# EAGLE schematic qo-100-gpsdo (EAGLE 9.6.2)
CREVISION: 1; DESIGNER: Joao Silva

## Sheet 1 of 6: MCU
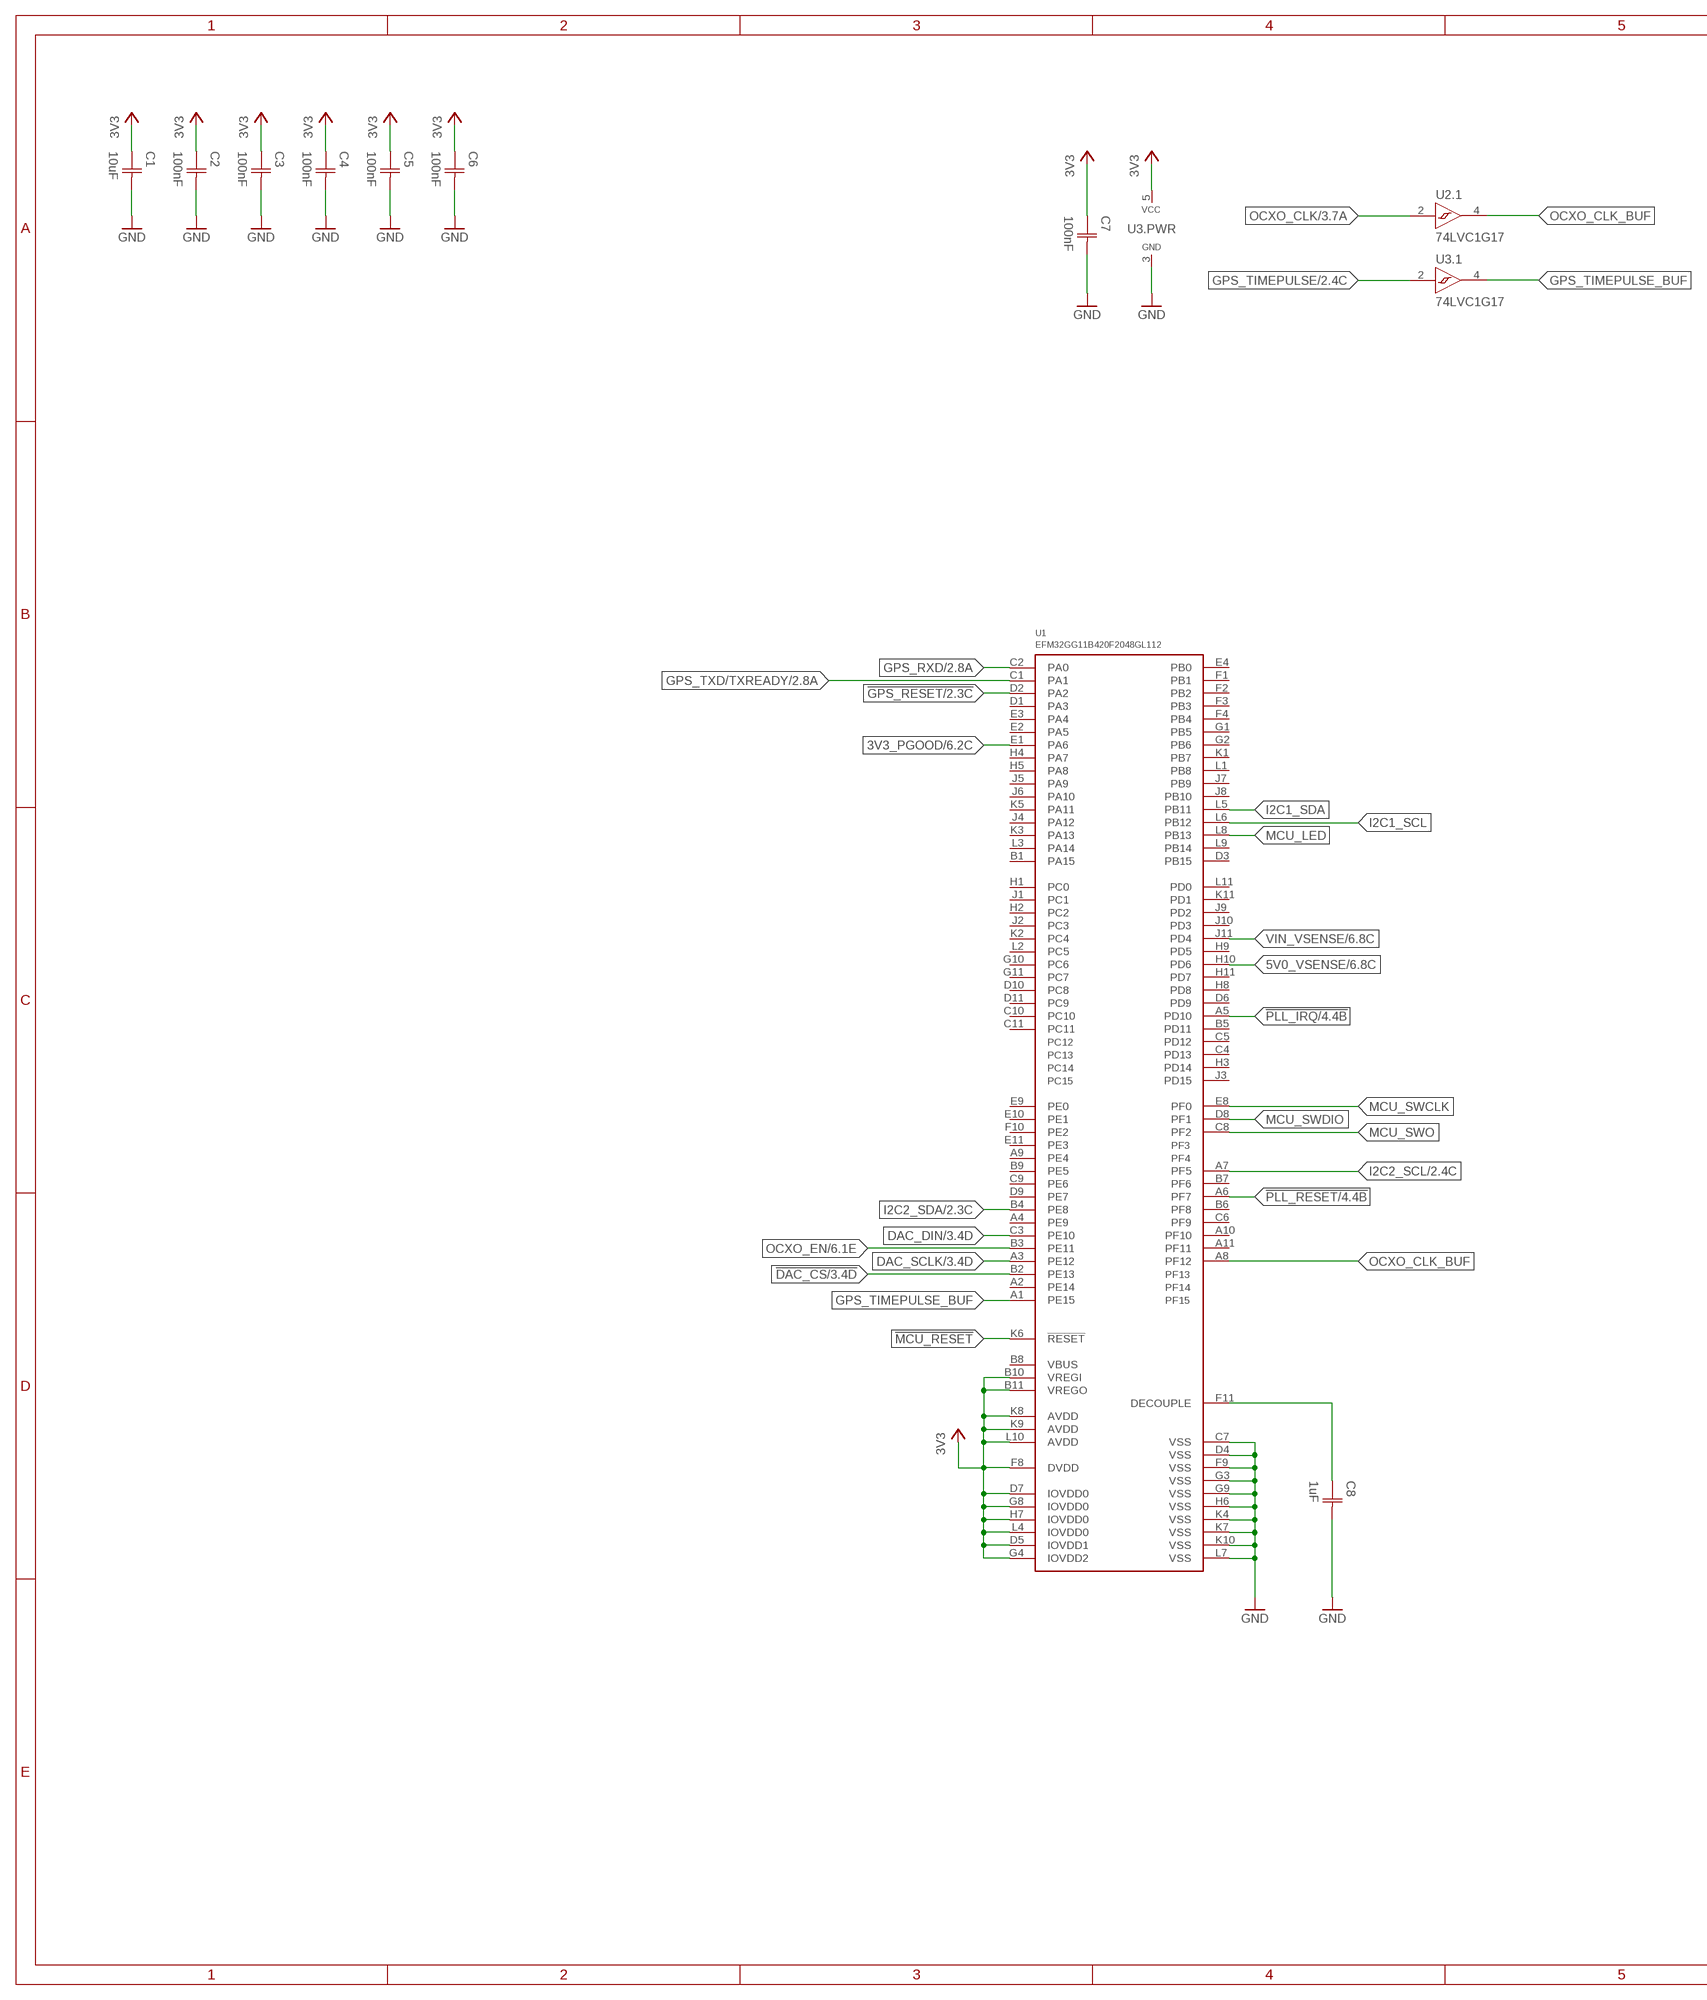
[diagram p0: schematic, sheet 1, part 1 of 2]
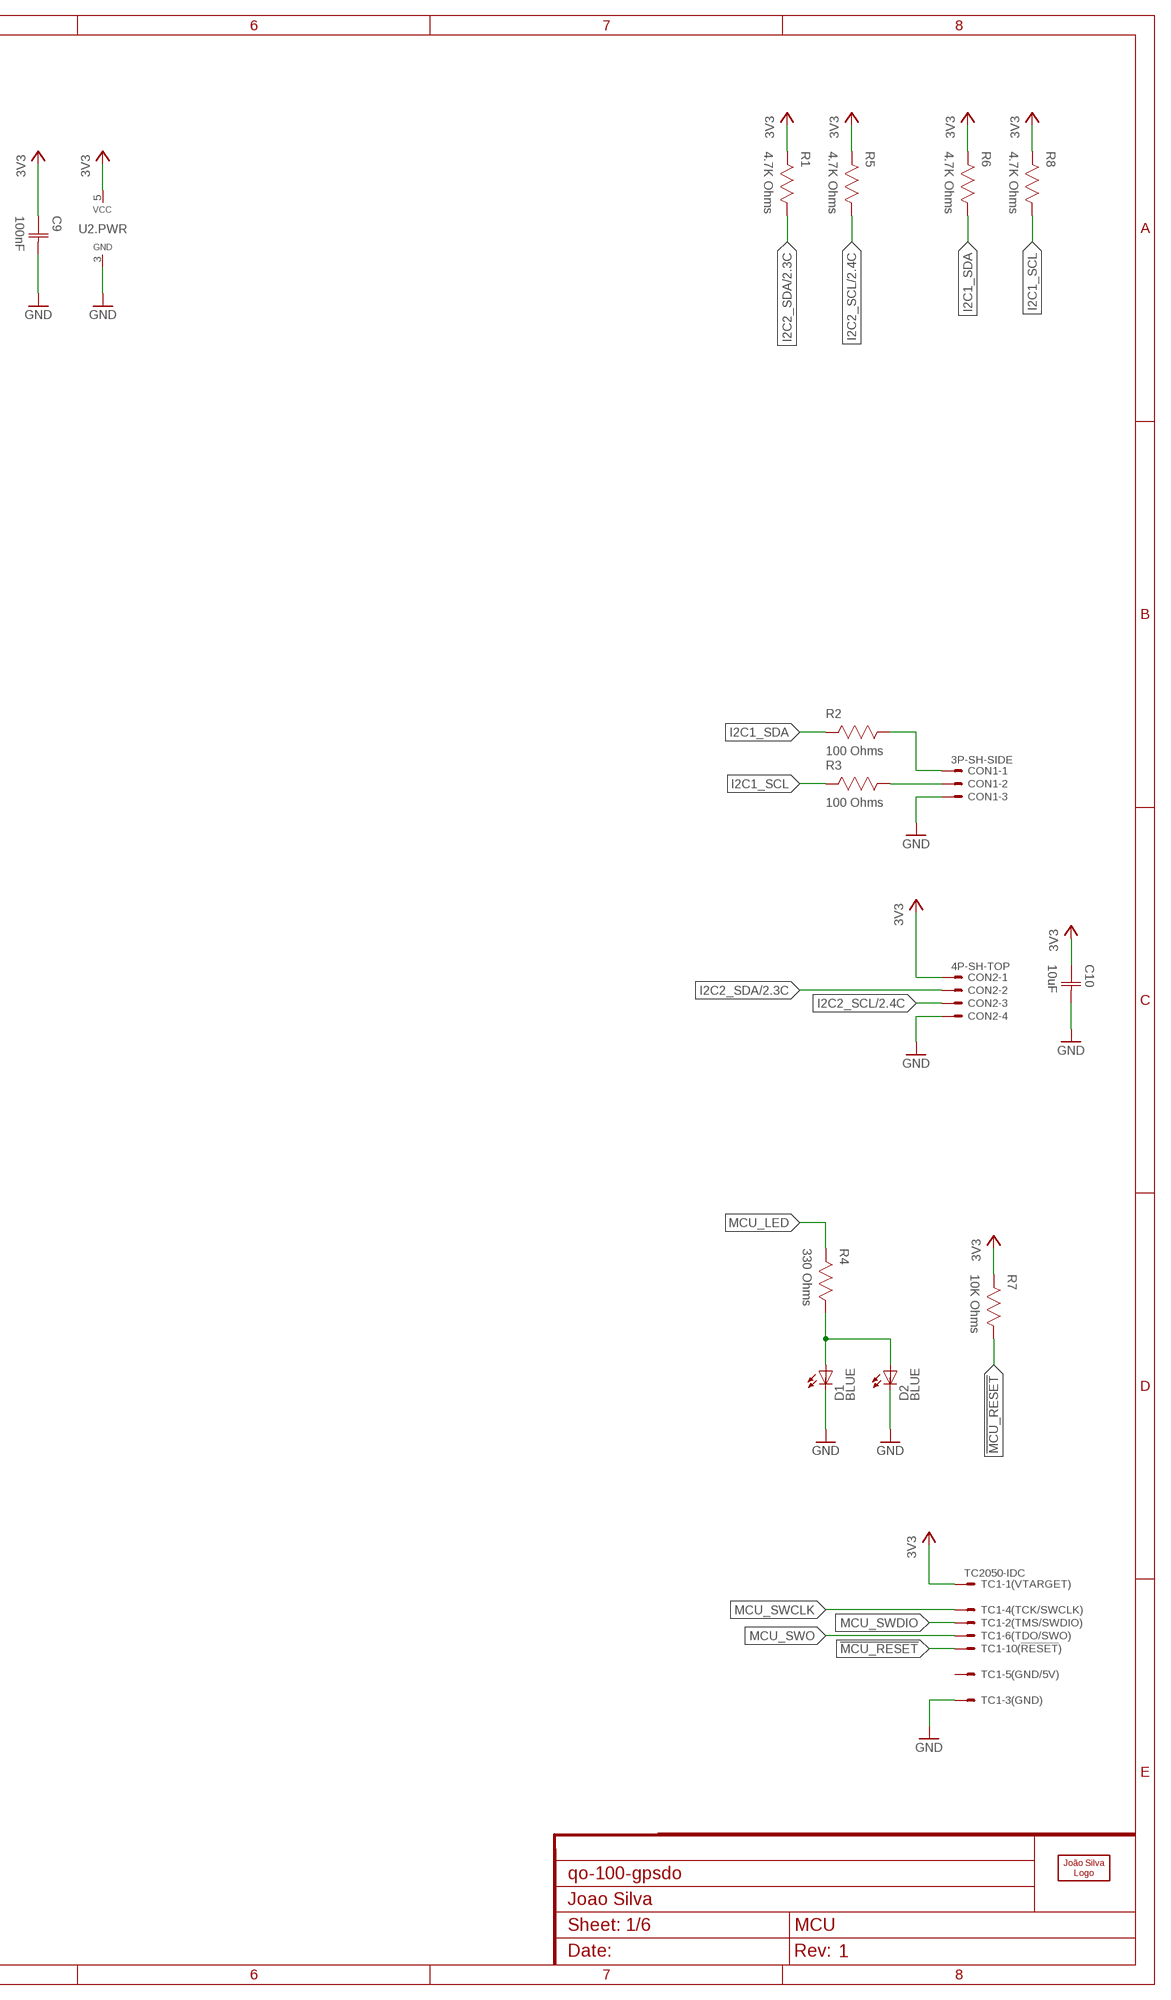
[diagram p1: schematic, sheet 1, part 2 of 2]

### Parts
C1  10uF  CAPACITOR-0603  [CAP0603]
C2  100nF  CAPACITOR-0402  [CAP0402]
C3  100nF  CAPACITOR-0402  [CAP0402]
C4  100nF  CAPACITOR-0402  [CAP0402]
C5  100nF  CAPACITOR-0402  [CAP0402]
C6  100nF  CAPACITOR-0402  [CAP0402]
C7  100nF  CAPACITOR-0402  [CAP0402]
C8  1uF  CAPACITOR-0402  [CAP0402]
C9  100nF  CAPACITOR-0402  [CAP0402]
C10  10uF  CAPACITOR-0603  [CAP0603]
CON1  3P-SH-SIDE  [SH-03-SIDE]
CON2  4P-SH-TOP  [SH-04-TOP]
D1  LED0603  [0603]
D2  LEDTH3MM  [LED_3MM]
LOGO1  JS-5MM  [JS_5MM]
R1  4.7K Ohms  RESISTOR-0402  [RES0402]
R2  100 Ohms  RESISTOR-0402  [RES0402]
R3  100 Ohms  RESISTOR-0402  [RES0402]
R4  330 Ohms  RESISTOR-0402  [RES0402]
R5  4.7K Ohms  RESISTOR-0402  [RES0402]
R6  4.7K Ohms  RESISTOR-0402  [RES0402]
R7  10K Ohms  RESISTOR-0402  [RES0402]
R8  4.7K Ohms  RESISTOR-0402  [RES0402]
TC1  TC2050-IDC  [TC2050-IDC]
U1  EFM32GG11B420F2048GL112  [BGA112]
U2  74LVC1G17  [SC70-5]
U3  74LVC1G17  [SC70-5]

### Nets
3V3: C1.1(C1) C2.1(C1) C3.1(C1) C4.1(C1) C5.1(C1) C6.1(C1) C7.1(C1) C9.1(C1) C10.1(C1) CON2.1 R1.2 R5.2 R6.2 R7.2 R8.2 TC1.1 U1.B10(VREGI) U1.B11(VREGO) U1.D5(IOVDD1) U1.D7(IOVDD0) U1.F8(DVDD) U1.G4(IOVDD2) U1.G8(IOVDD0) U1.H7(IOVDD0) U1.K8(AVDD) U1.K9(AVDD) U1.L4(IOVDD0) U1.L10(AVDD) U2.5(.PWR:VCC) U3.5(.PWR:VCC) ; also sheet 2,3,4,6
3V3_PGOOD: U1.E1(PA6) ; also sheet 6
5V0_VSENSE: U1.H10(PD6) ; also sheet 6
!DAC_CS: U1.B2(PE13) ; also sheet 3
!GPS_RESET: U1.D2(PA2) ; also sheet 2
!MCU_RESET: R7.1 TC1.10 U1.K6(!RESET)
!PLL_IRQ: U1.A5(PD10) ; also sheet 4
!PLL_RESET: U1.A6(PF7) ; also sheet 4
DAC_DIN: U1.C3(PE10) ; also sheet 3
DAC_SCLK: U1.A3(PE12) ; also sheet 3
GND: C1.2(C2) C2.2(C2) C3.2(C2) C4.2(C2) C5.2(C2) C6.2(C2) C7.2(C2) C8.2(C2) C9.2(C2) C10.2(C2) CON1.3 CON2.4 D1.C D2.K(C) TC1.3 U1.C7(VSS) U1.D4(VSS) U1.F9(VSS) U1.G3(VSS) U1.G9(VSS) U1.H6(VSS) U1.K4(VSS) U1.K7(VSS) U1.K10(VSS) U1.L7(VSS) U2.3(.PWR:GND) U3.3(.PWR:GND) ; also sheet 2,3,4,5,6
GPS_RXD: U1.C2(PA0) ; also sheet 2
GPS_TIMEPULSE: U3.2(.1:A) ; also sheet 2,4
GPS_TIMEPULSE_BUF: U1.A1(PE15) U3.4(.1:Y)
GPS_TXD/TXREADY: U1.C1(PA1) ; also sheet 2
I2C1_SCL: R3.2 R8.1 U1.L6(PB12)
I2C1_SDA: R2.2 R6.1 U1.L5(PB11)
I2C2_SCL: CON2.3 R5.1 U1.A7(PF5) ; also sheet 2,4
I2C2_SDA: CON2.2 R1.1 U1.B4(PE8) ; also sheet 2,4
MCU_LED: R4.2 U1.L8(PB13)
MCU_SWCLK: TC1.4 U1.E8(PF0)
MCU_SWDIO: TC1.2 U1.D8(PF1)
MCU_SWO: TC1.6 U1.C8(PF2)
MCU_VCORE: C8.1(C1) U1.F11(DECOUPLE)
N$9: CON1.2 R3.1
N$19: CON1.1 R2.1
N$144: D1.A D2.A R4.1
OCXO_CLK: U2.2(.1:A) ; also sheet 3,4
OCXO_CLK_BUF: U1.A8(PF12) U2.4(.1:Y)
OCXO_EN: U1.B3(PE11) ; also sheet 6
VIN_VSENSE: U1.J11(PD4) ; also sheet 6
Unconnected: TC1.5 TC1.7 TC1.8 TC1.9 U1.A2(PE14) U1.A4(PE9) U1.A9(PE4) U1.A10(PF10) U1.A11(PF11) U1.B1(PA15) U1.B5(PD11) U1.B6(PF8) U1.B7(PF6) U1.B8(VBUS) U1.B9(PE5) U1.C4(PD13) U1.C5(PD12) U1.C6(PF9) U1.C9(PE6) U1.C10 U1.C11 U1.D1(PA3) U1.D3(PB15) U1.D6(PD9) U1.D9(PE7) U1.D10(PC8) U1.D11(PC9) U1.E2(PA5) U1.E3(PA4) U1.E4(PB0) U1.E9(PE0) U1.E10(PE1) U1.E11(PE3) U1.F1(PB1) U1.F2(PB2) U1.F3(PB3) U1.F4(PB4) U1.F10(PE2) U1.G1(PB5) U1.G2(PB6) U1.G10(PC6) U1.G11(PC7) U1.H1(PC0) U1.H2(PC2) U1.H3(PD14) U1.H4(PA7) U1.H5(PA8) U1.H8(PD8) U1.H9(PD5) U1.H11(PD7) U1.J1(PC1) U1.J2(PC3) U1.J3(PD15) U1.J4(PA12) U1.J5(PA9) U1.J6(PA10) U1.J7(PB9) U1.J8(PB10) U1.J9(PD2) U1.J10(PD3) U1.K1(PB7) U1.K2(PC4) U1.K3(PA13) U1.K5(PA11) U1.K11(PD1) U1.L1(PB8) U1.L2(PC5) U1.L3(PA14) U1.L9(PB14) U1.L11(PD0)

## Sheet 2 of 6: GPS Receiver
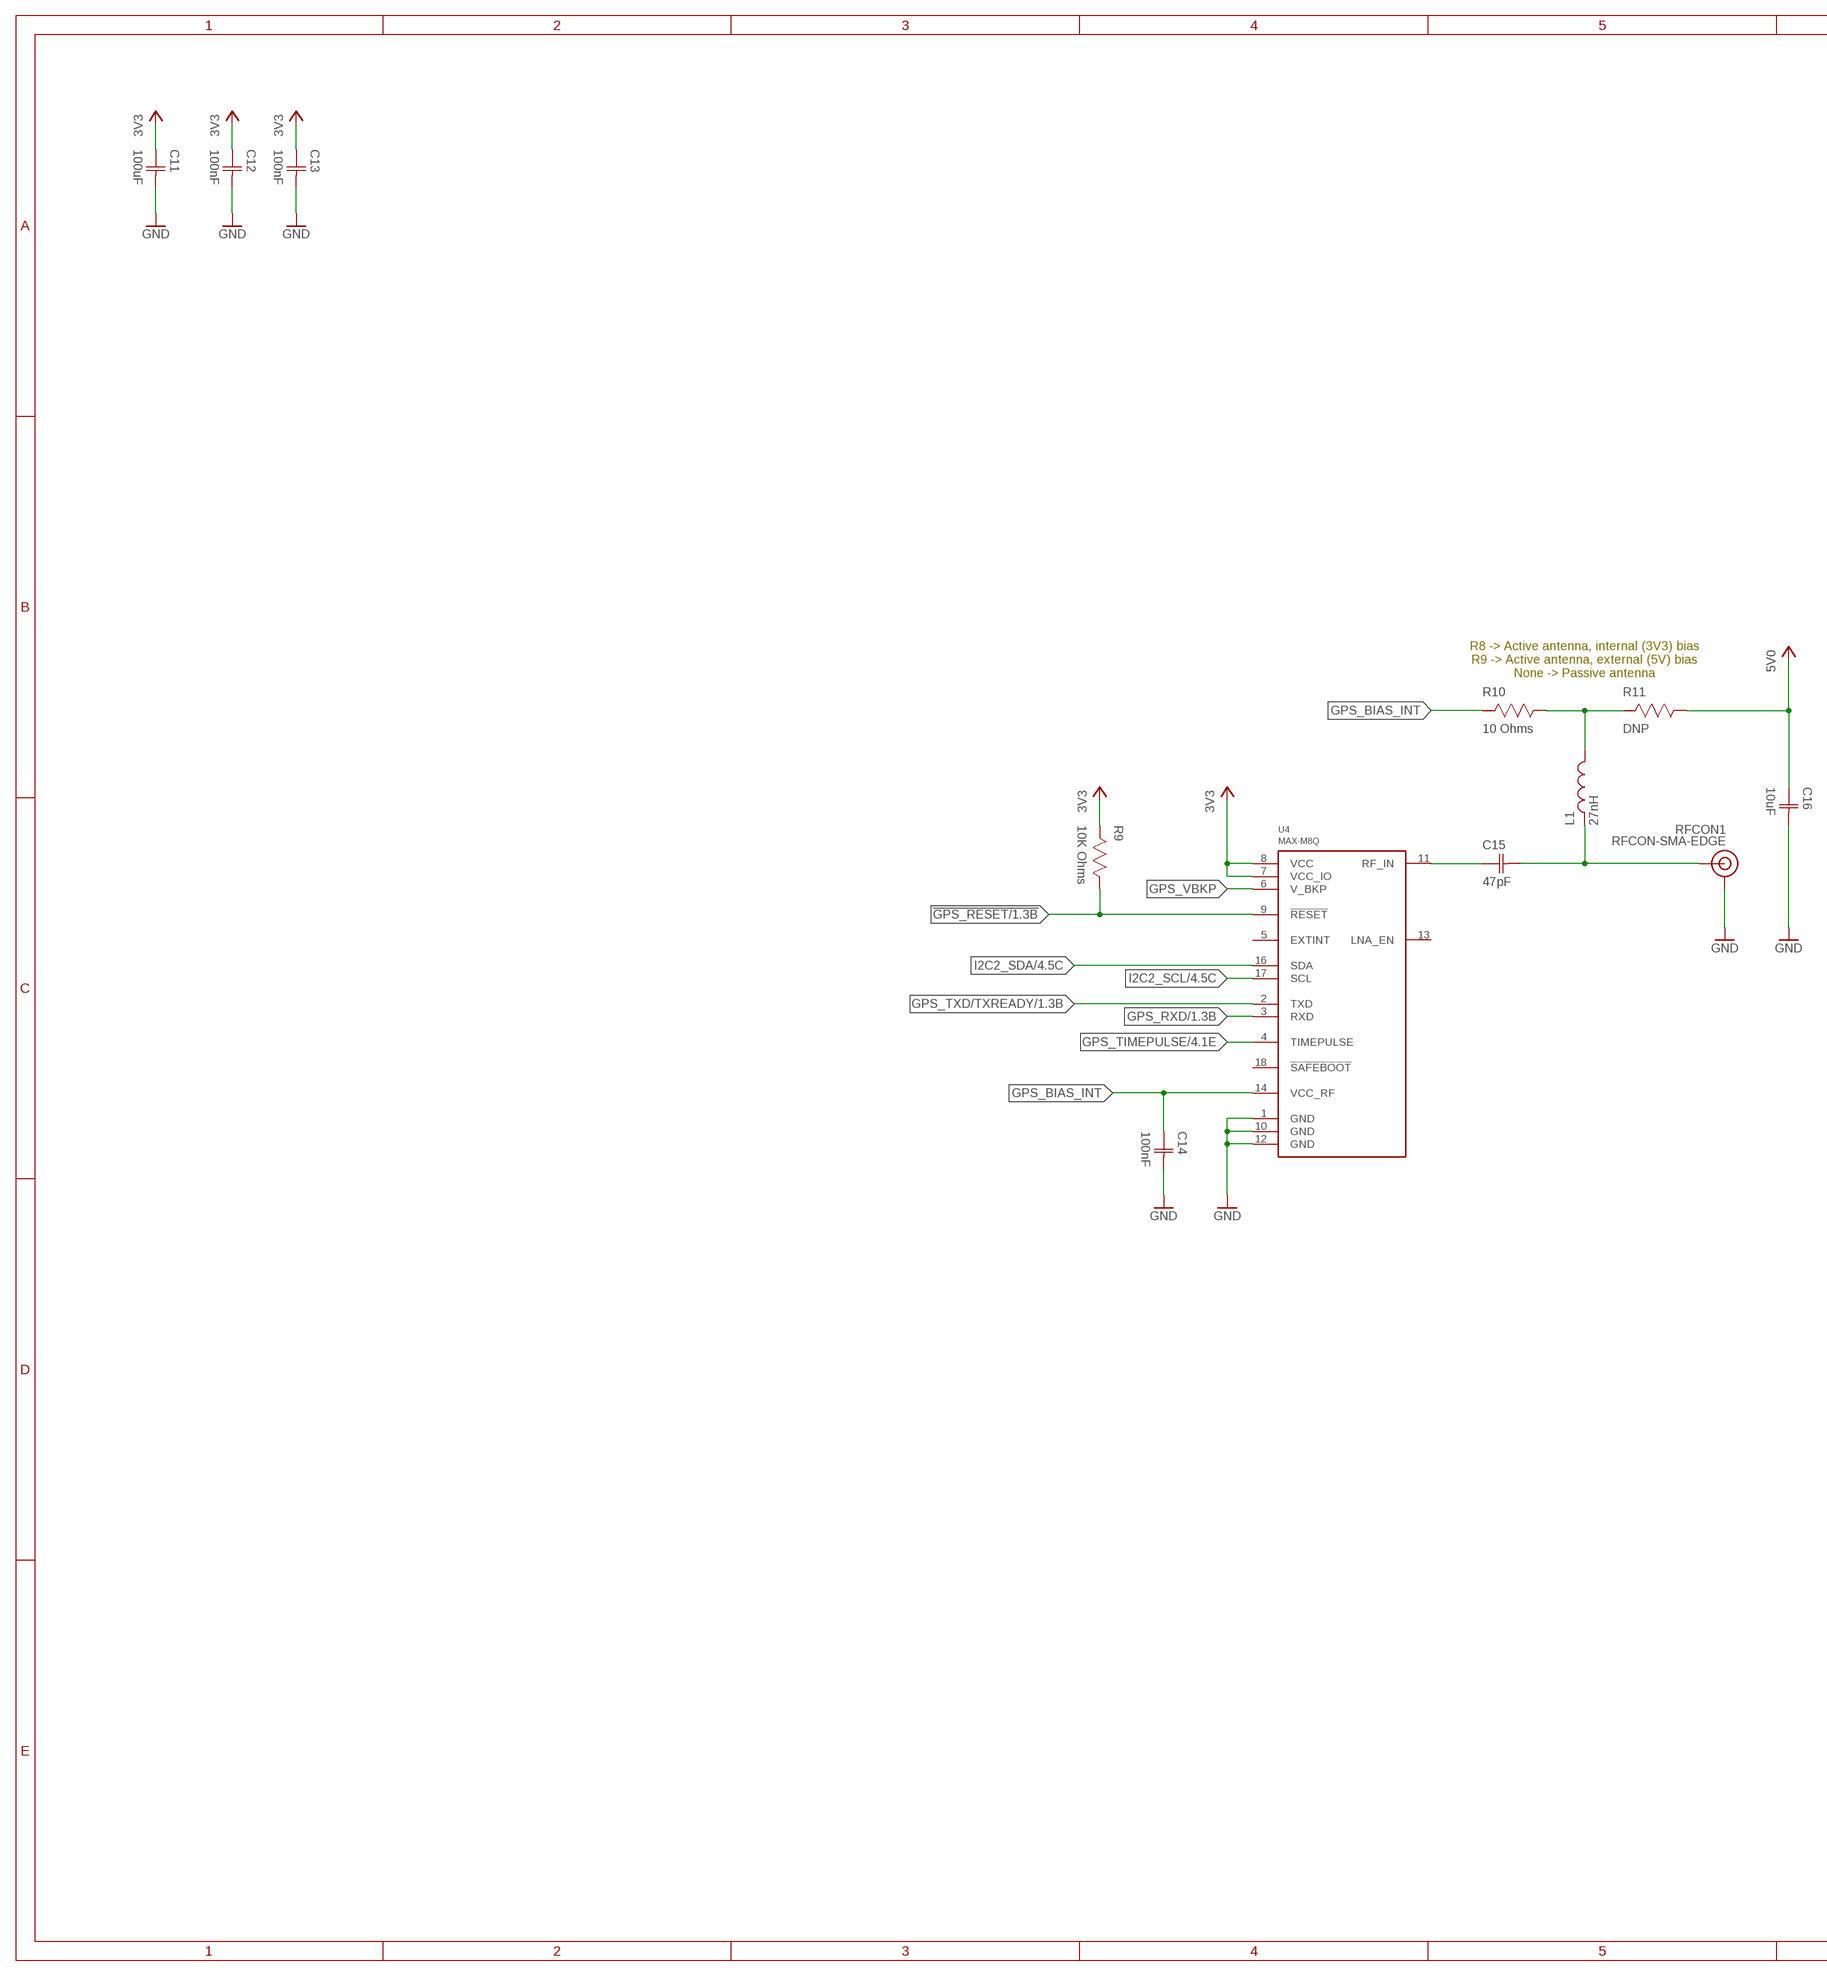
[diagram p2: schematic, sheet 2, part 1 of 2]
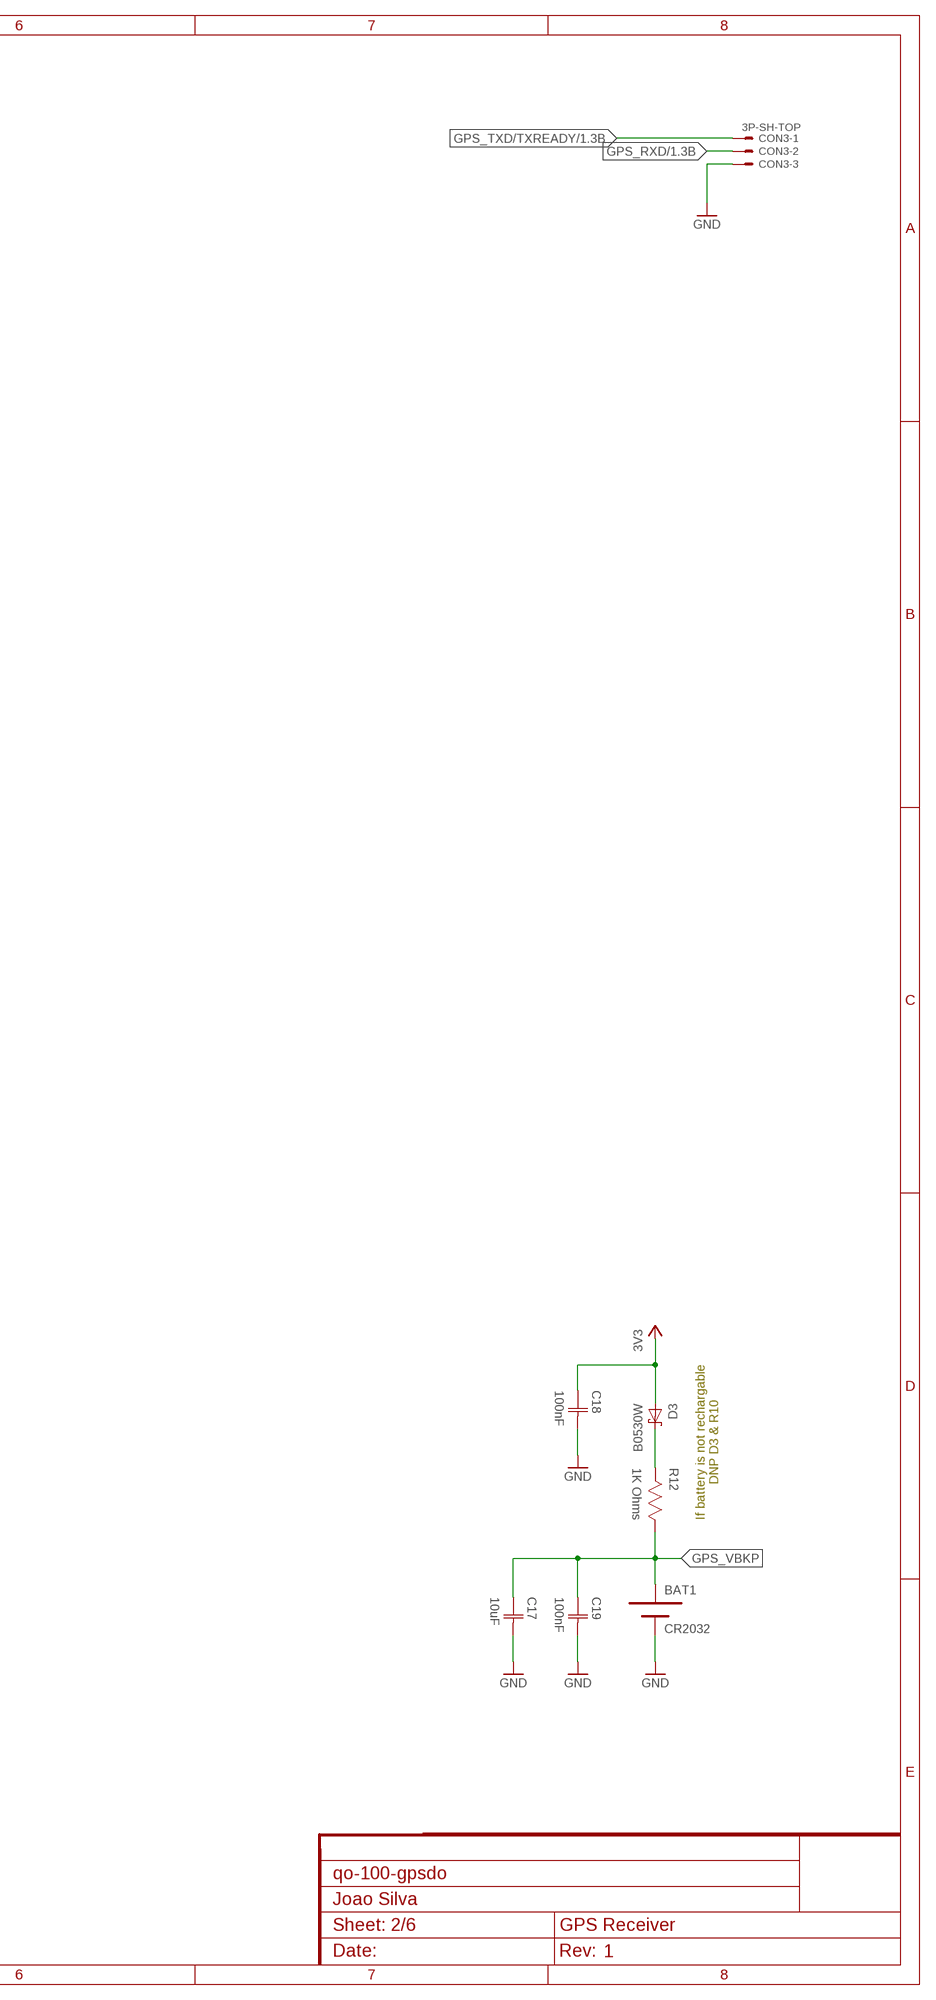
[diagram p3: schematic, sheet 2, part 2 of 2]

### Parts
BAT1  CR2032  [CR2032]
C11  100uF  CAPACITOR-1206  [CAP1206]
C12  100nF  CAPACITOR-0402  [CAP0402]
C13  100nF  CAPACITOR-0402  [CAP0402]
C14  100nF  CAPACITOR-0402  [CAP0402]
C15  47pF  CAPACITOR-0402  [CAP0402]
C16  10uF  CAPACITOR-0603  [CAP0603]
C17  10uF  CAPACITOR-0603  [CAP0603]
C18  100nF  CAPACITOR-0402  [CAP0402]
C19  100nF  CAPACITOR-0402  [CAP0402]
CON3  3P-SH-TOP  [SH-03-TOP]
D3  B0530W  [SOD-123]
L1  27nH  INDUCTOR-0805  [IND0805]
R9  10K Ohms  RESISTOR-0402  [RES0402]
R10  10 Ohms  RESISTOR-0603  [RES0603]
R11  DNP  RESISTOR-0603  [RES0603]
R12  1K Ohms  RESISTOR-0402  [RES0402]
RFCON1  RFCON-SMA-EDGE  [SMA-EDGE]
U4  MAX-M8Q  [MAX-M8]

### Nets
3V3: C11.1(C1) C12.1(C1) C13.1(C1) C18.1(C1) D3.A R9.2 U4.7(VCC_IO) U4.8(VCC) ; also sheet 1,3,4,6
5V0: C16.1(C1) R11.1 ; also sheet 6
!GPS_RESET: R9.1 U4.9(!RESET) ; also sheet 1
GND: BAT1.- C11.2(C2) C12.2(C2) C13.2(C2) C14.2(C2) C16.2(C2) C17.2(C2) C18.2(C2) C19.2(C2) CON3.3 RFCON1.GND@0(GND) RFCON1.GND@1(GND) RFCON1.GND@2(GND) RFCON1.GND@3(GND) U4.1(GND) U4.10(GND) U4.12(GND) ; also sheet 1,3,4,5,6
GPS_BIAS_INT: C14.1(C1) R10.2 U4.14(VCC_RF)
GPS_RXD: CON3.2 U4.3(RXD) ; also sheet 1
GPS_TIMEPULSE: U4.4(TIMEPULSE) ; also sheet 1,4
GPS_TXD/TXREADY: CON3.1 U4.2(TXD) ; also sheet 1
GPS_VBKP: BAT1.+ C17.1(C1) C19.1(C1) R12.1 U4.6(V_BKP)
I2C2_SCL: U4.17(SCL) ; also sheet 1,4
I2C2_SDA: U4.16(SDA) ; also sheet 1,4
N$11: D3.C R12.2
N$12: C15.1(C1) U4.11(RF_IN)
N$13: C15.2(C2) L1.1 RFCON1.SIG(SIGNAL)
N$14: L1.2 R10.1 R11.2
Unconnected: U4.5(EXTINT) U4.13(LNA_EN) U4.18(!SAFEBOOT)

### Notes on the sheet
- R8 -> Active antenna, internal (3V3) bias
  R9 -> Active antenna, external (5V) bias
  None -> Passive antenna
- If battery is not rechargable
  DNP D3 & R10

## Sheet 3 of 6: OCXO
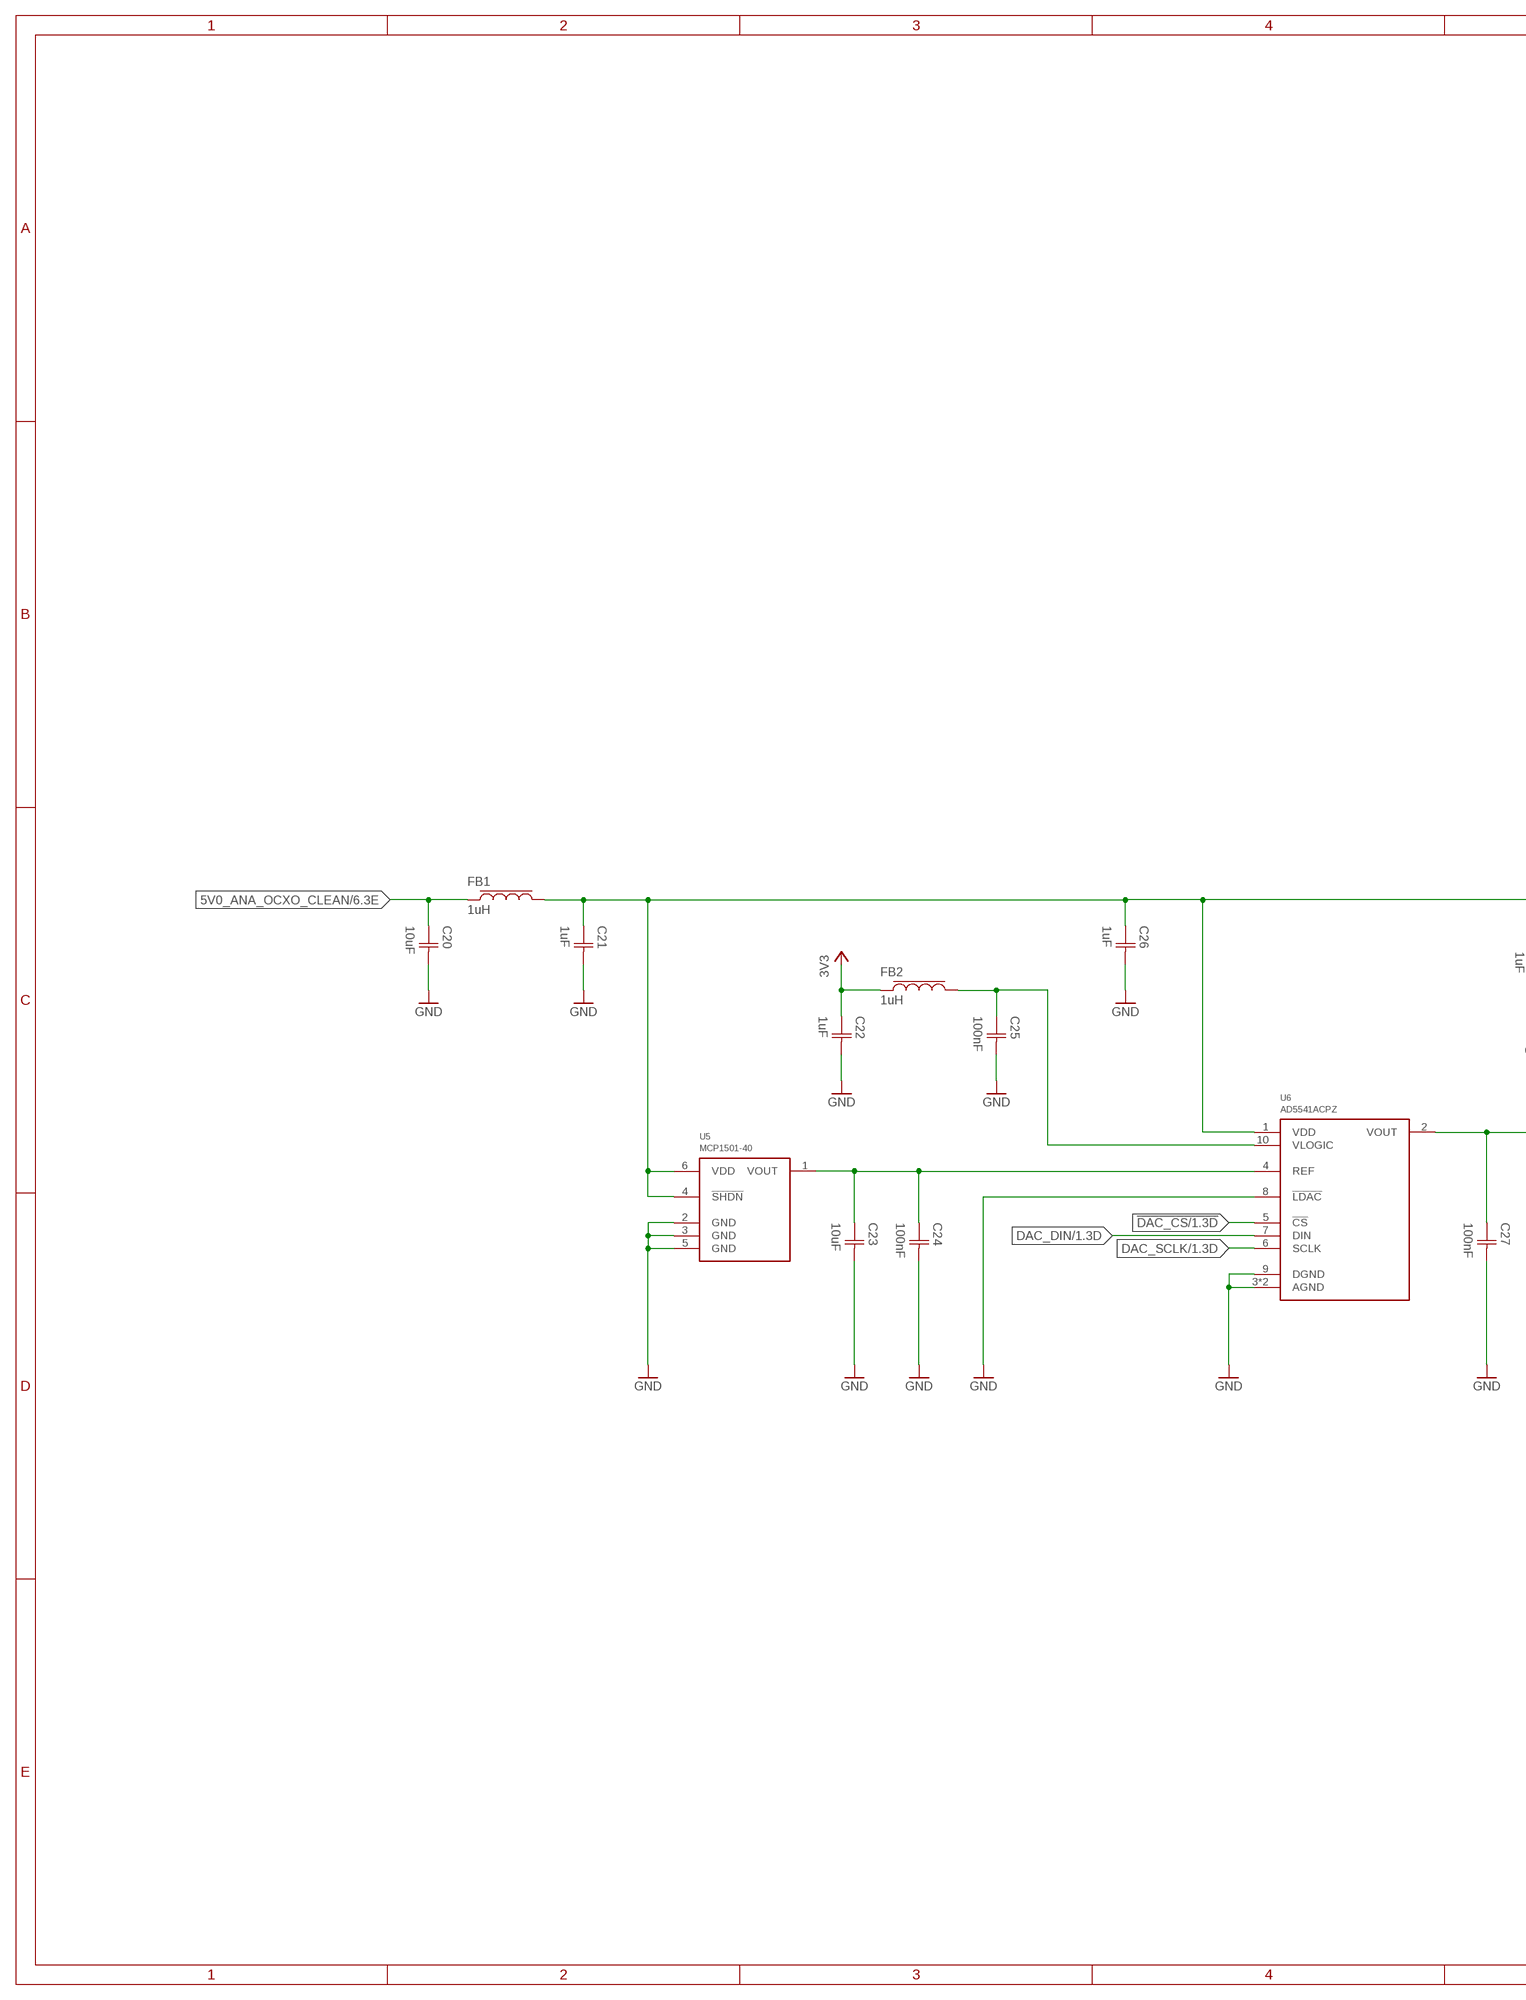
[diagram p4: schematic, sheet 3, part 1 of 2]
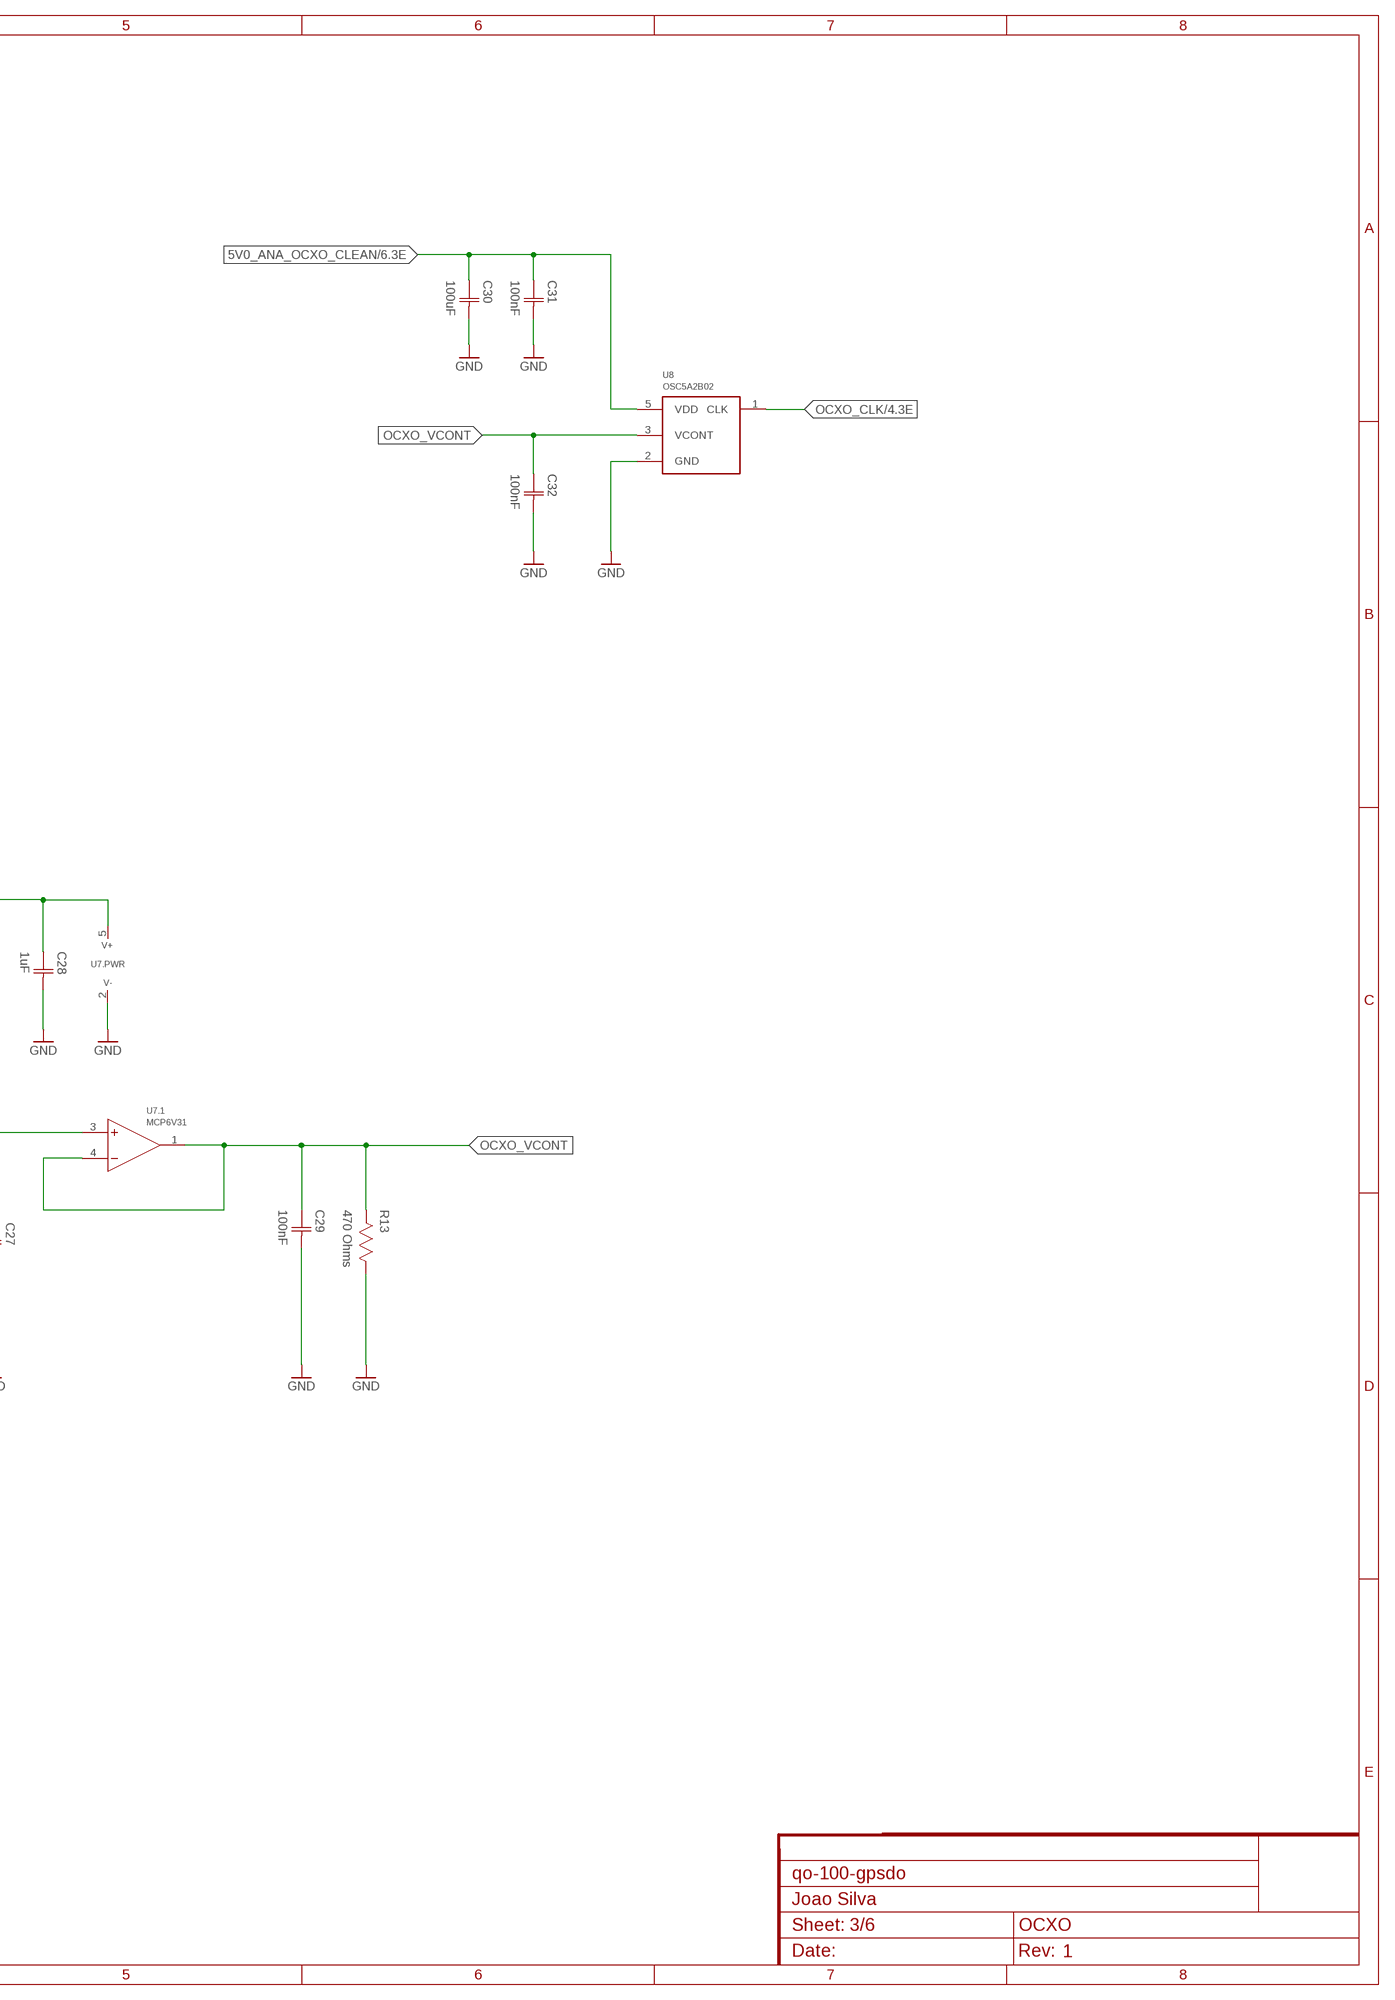
[diagram p5: schematic, sheet 3, part 2 of 2]

### Parts
C20  10uF  CAPACITOR-0603  [CAP0603]
C21  1uF  CAPACITOR-0402  [CAP0402]
C22  1uF  CAPACITOR-0402  [CAP0402]
C23  10uF  CAPACITOR-0603  [CAP0603]
C24  100nF  CAPACITOR-0402  [CAP0402]
C25  100nF  CAPACITOR-0402  [CAP0402]
C26  1uF  CAPACITOR-0402  [CAP0402]
C27  100nF  CAPACITOR-0402  [CAP0402]
C28  1uF  CAPACITOR-0402  [CAP0402]
C29  100nF  CAPACITOR-0402  [CAP0402]
C30  100uF  CAPACITOR-1206  [CAP1206]
C31  100nF  CAPACITOR-0402  [CAP0402]
C32  100nF  CAPACITOR-0402  [CAP0402]
FB1  1uH  FERRITE-0603  [IND0603]
FB2  1uH  FERRITE-0603  [IND0603]
R13  470 Ohms  RESISTOR-0402  [RES0402]
U5  MCP1501-40  [SOT23-6]
U6  AD5541ACPZ  [DFN10]
U7  MCP6V31  [SOT23-5]
U8  OSC5A2B02  [OSC5A2B02]

### Nets
3V3: C22.1(C1) FB2.1 ; also sheet 1,2,4,6
5V0_ANA_OCXO_CLEAN: C20.1(C1) C30.1(C1) C31.1(C1) FB1.1 U8.5(VDD) ; also sheet 6
5V0_ANA_OCXO_CLEAN_FILT: C21.1(C1) C26.1(C1) C28.1(C1) FB1.2 U5.4(!SHDN) U5.6(VDD) U6.1(VDD) U7.5(.PWR:V+)
!DAC_CS: U6.5(!CS) ; also sheet 1
DAC_DIN: U6.7(DIN) ; also sheet 1
DAC_SCLK: U6.6(SCLK) ; also sheet 1
GND: C20.2(C2) C21.2(C2) C22.2(C2) C23.2(C2) C24.2(C2) C25.2(C2) C26.2(C2) C27.2(C2) C28.2(C2) C29.2(C2) C30.2(C2) C31.2(C2) C32.2(C2) R13.1 U5.2(GND) U5.3(GND) U5.5(GND) U6.3(AGND) U6.8(!LDAC) U6.9(DGND) U6.11(AGND) U7.2(.PWR:V-) U8.2(GND) ; also sheet 1,2,4,5,6
N$7: C27.1(C1) U6.2(VOUT) U7.3(.1:+IN)
N$27: C25.1(C1) FB2.2 U6.10(VLOGIC)
N$37: C23.1(C1) C24.1(C1) U5.1(VOUT) U6.4(REF)
OCXO_CLK: U8.1(CLK) ; also sheet 1,4
OCXO_VCONT: C29.1(C1) C32.1(C1) R13.2 U7.1(.1:OUT) U7.4(.1:-IN) U8.3(VCONT)

## Sheet 4 of 6: PLL
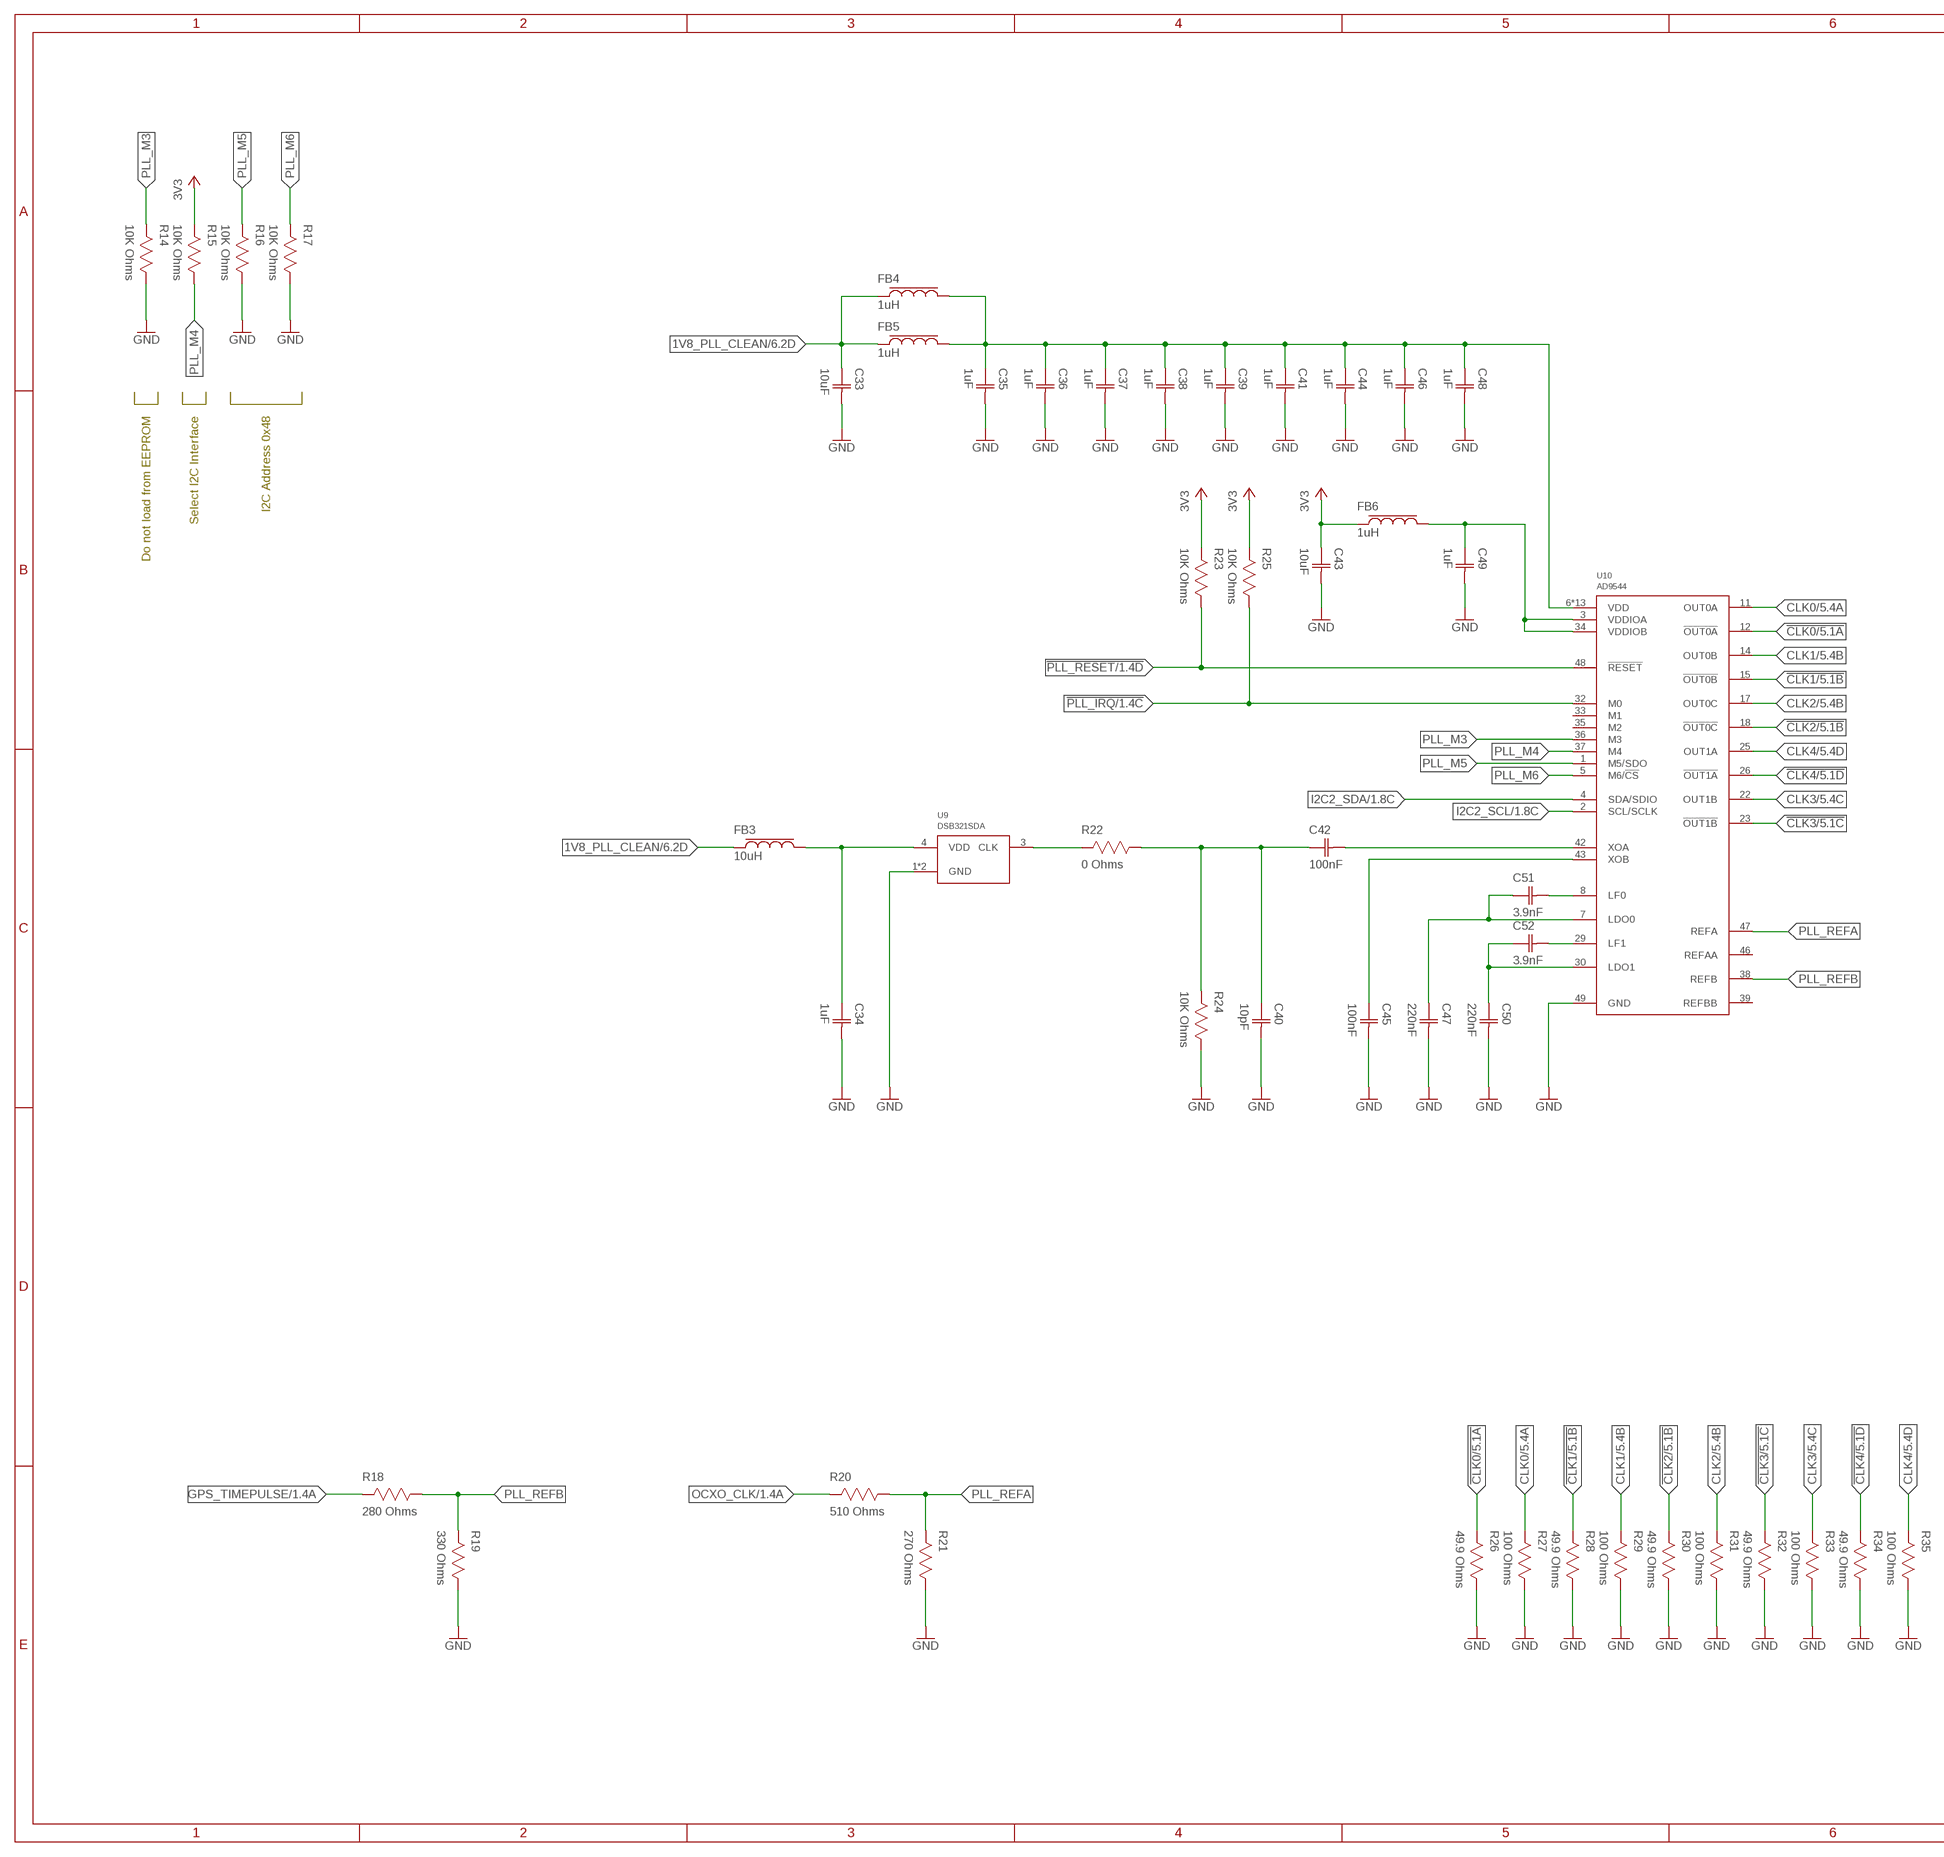
[diagram p6: schematic, sheet 4, part 1 of 2]
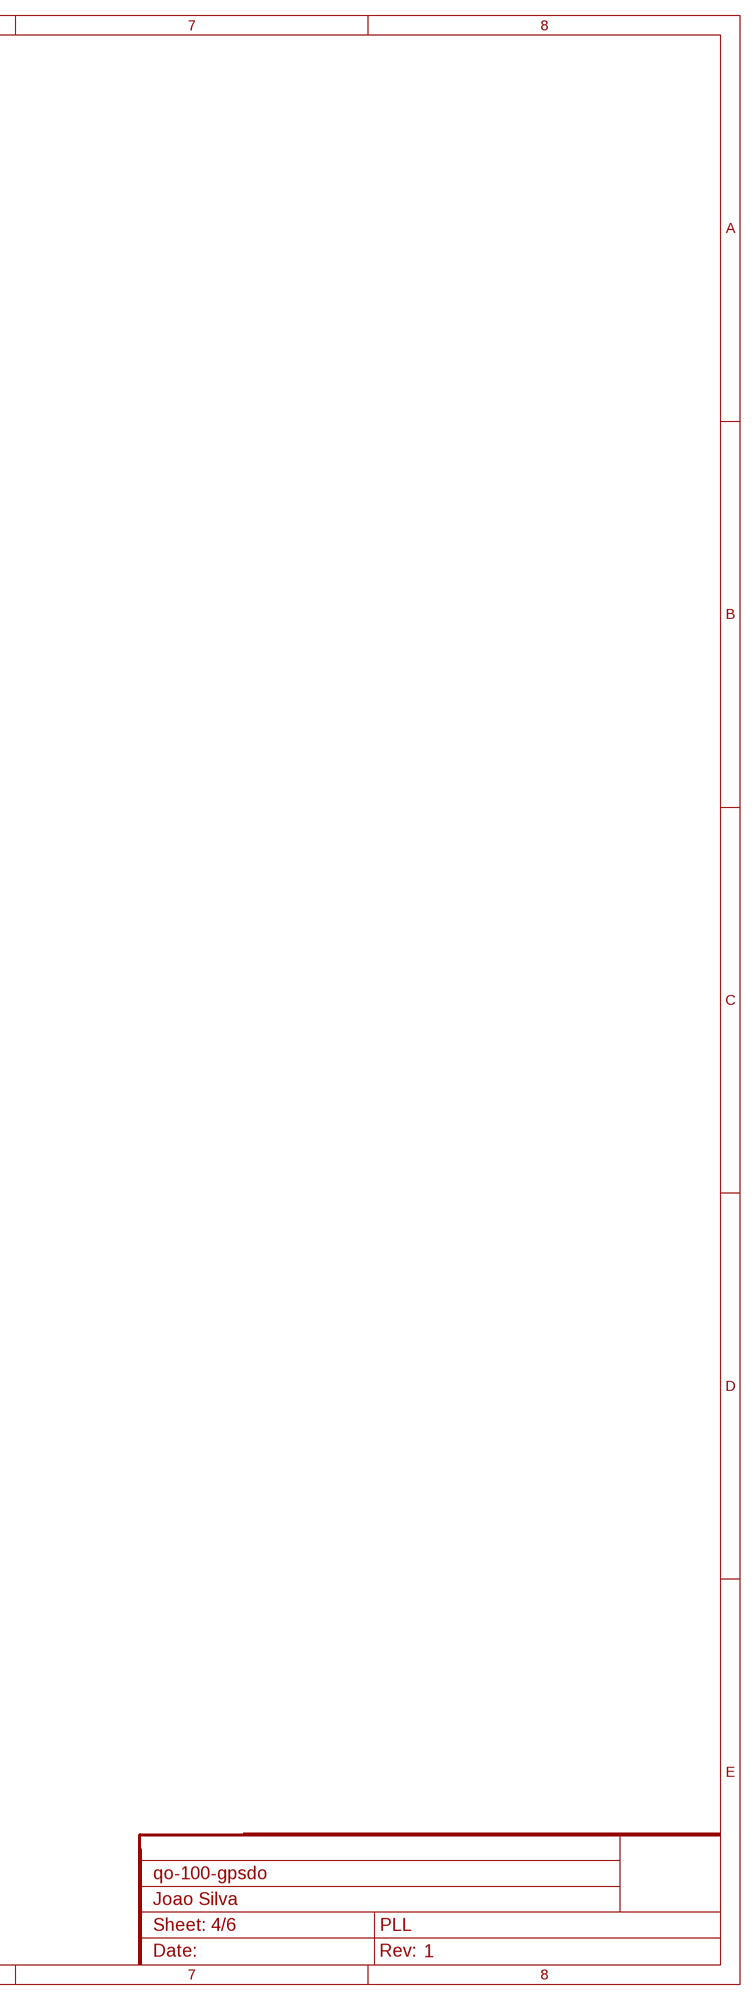
[diagram p7: schematic, sheet 4, part 2 of 2]

### Parts
C33  10uF  CAPACITOR-0603  [CAP0603]
C34  1uF  CAPACITOR-0402  [CAP0402]
C35  1uF  CAPACITOR-0402  [CAP0402]
C36  1uF  CAPACITOR-0402  [CAP0402]
C37  1uF  CAPACITOR-0402  [CAP0402]
C38  1uF  CAPACITOR-0402  [CAP0402]
C39  1uF  CAPACITOR-0402  [CAP0402]
C40  10pF  CAPACITOR-0402  [CAP0402]
C41  1uF  CAPACITOR-0402  [CAP0402]
C42  100nF  CAPACITOR-0402  [CAP0402]
C43  10uF  CAPACITOR-0603  [CAP0603]
C44  1uF  CAPACITOR-0402  [CAP0402]
C45  100nF  CAPACITOR-0402  [CAP0402]
C46  1uF  CAPACITOR-0402  [CAP0402]
C47  220nF  CAPACITOR-0402  [CAP0402]
C48  1uF  CAPACITOR-0402  [CAP0402]
C49  1uF  CAPACITOR-0402  [CAP0402]
C50  220nF  CAPACITOR-0402  [CAP0402]
C51  3.9nF  CAPACITOR-0402  [CAP0402]
C52  3.9nF  CAPACITOR-0402  [CAP0402]
FB3  10uH  FERRITE-0603  [IND0603]
FB4  1uH  FERRITE-0603  [IND0603]
FB5  1uH  FERRITE-0603  [IND0603]
FB6  1uH  FERRITE-0603  [IND0603]
R14  10K Ohms  RESISTOR-0402  [RES0402]
R15  10K Ohms  RESISTOR-0402  [RES0402]
R16  10K Ohms  RESISTOR-0402  [RES0402]
R17  10K Ohms  RESISTOR-0402  [RES0402]
R18  280 Ohms  RESISTOR-0402  [RES0402]
R19  330 Ohms  RESISTOR-0402  [RES0402]
R20  510 Ohms  RESISTOR-0402  [RES0402]
R21  270 Ohms  RESISTOR-0402  [RES0402]
R22  0 Ohms  RESISTOR-0402  [RES0402]
R23  10K Ohms  RESISTOR-0402  [RES0402]
R24  10K Ohms  RESISTOR-0402  [RES0402]
R25  10K Ohms  RESISTOR-0402  [RES0402]
R26  49.9 Ohms  RESISTOR-0402  [RES0402]
R27  100 Ohms  RESISTOR-0402  [RES0402]
R28  49.9 Ohms  RESISTOR-0402  [RES0402]
R29  100 Ohms  RESISTOR-0402  [RES0402]
R30  49.9 Ohms  RESISTOR-0402  [RES0402]
R31  100 Ohms  RESISTOR-0402  [RES0402]
R32  49.9 Ohms  RESISTOR-0402  [RES0402]
R33  100 Ohms  RESISTOR-0402  [RES0402]
R34  49.9 Ohms  RESISTOR-0402  [RES0402]
R35  100 Ohms  RESISTOR-0402  [RES0402]
U9  DSB321SDA  [TCXO-3225]
U10  AD9544  [QFN48_2]

### Nets
1V8_PLL_CLEAN: C33.1(C1) FB3.1 FB4.1 FB5.1 ; also sheet 6
1V8_PLL_CLEAN_FILT: C35.1(C1) C36.1(C1) C37.1(C1) C38.1(C1) C39.1(C1) C41.1(C1) C44.1(C1) C46.1(C1) C48.1(C1) FB4.2 FB5.2 U10.6(VDD) U10.9(VDD) U10.10(VDD) U10.13(VDD) U10.19(VDD) U10.20(VDD) U10.24(VDD) U10.27(VDD) U10.28(VDD) U10.31(VDD) U10.40(VDD) U10.41(VDD) U10.45(VDD)
3V3: C43.1(C1) FB6.1 R15.2 R23.2 R25.2 ; also sheet 1,2,3,6
3V3_PLL_FILT: C49.1(C1) FB6.2 U10.3(VDDIOA) U10.34(VDDIOB)
!CLK0: R26.2 U10.12(!OUT0A) ; also sheet 5
!CLK1: R28.2 U10.15(!OUT0B) ; also sheet 5
!CLK2: R30.2 U10.18(!OUT0C) ; also sheet 5
!CLK3: R32.2 U10.23(!OUT1B) ; also sheet 5
!CLK4: R34.2 U10.26(!OUT1A) ; also sheet 5
!PLL_IRQ: R25.1 U10.32(M0) ; also sheet 1
!PLL_RESET: R23.1 U10.48(!RESET) ; also sheet 1
CLK0: R27.2 U10.11(OUT0A) ; also sheet 5
CLK1: R29.2 U10.14(OUT0B) ; also sheet 5
CLK2: R31.2 U10.17(OUT0C) ; also sheet 5
CLK3: R33.2 U10.22(OUT1B) ; also sheet 5
CLK4: R35.2 U10.25(OUT1A) ; also sheet 5
GND: C33.2(C2) C34.2(C2) C35.2(C2) C36.2(C2) C37.2(C2) C38.2(C2) C39.2(C2) C40.2(C2) C41.2(C2) C43.2(C2) C44.2(C2) C45.2(C2) C46.2(C2) C47.2(C2) C48.2(C2) C49.2(C2) C50.2(C2) R14.1 R16.1 R17.1 R19.1 R21.1 R24.1 R26.1 R27.1 R28.1 R29.1 R30.1 R31.1 R32.1 R33.1 R34.1 R35.1 U9.1(GND) U9.2(GND) U10.49(GND) ; also sheet 1,2,3,5,6
GPS_TIMEPULSE: R18.2 ; also sheet 1,2
I2C2_SCL: U10.2(SCL/SCLK) ; also sheet 1,2
I2C2_SDA: U10.4(SDA/SDIO) ; also sheet 1,2
N$17: C40.1(C1) C42.1(C1) R22.1 R24.2
N$18: R22.2 U9.3(CLK)
N$20: C50.1(C1) C52.1(C1) U10.30(LDO1)
N$21: C47.1(C1) C51.1(C1) U10.7(LDO0)
N$22: C52.2(C2) U10.29(LF1)
N$23: C51.2(C2) U10.8(LF0)
N$30: C45.1(C1) U10.43(XOB)
N$91: C42.2(C2) U10.42(XOA)
N$103: C34.1(C1) FB3.2 U9.4(VDD)
OCXO_CLK: R20.2 ; also sheet 1,3
PLL_M3: R14.2 U10.36(M3)
PLL_M4: R15.1 U10.37(M4)
PLL_M5: R16.2 U10.1(M5/SDO)
PLL_M6: R17.2 U10.5(M6/!CS)
PLL_REFA: R20.1 R21.2 U10.47(REFA)
PLL_REFB: R18.1 R19.2 U10.38(REFB)
Unconnected: U10.33(M1) U10.35(M2) U10.39(REFBB) U10.46(REFAA)

### Notes on the sheet
- Do not load from EEPROM | Select I2C Interface | I2C Address 0x48

## Sheet 5 of 6: Output stages
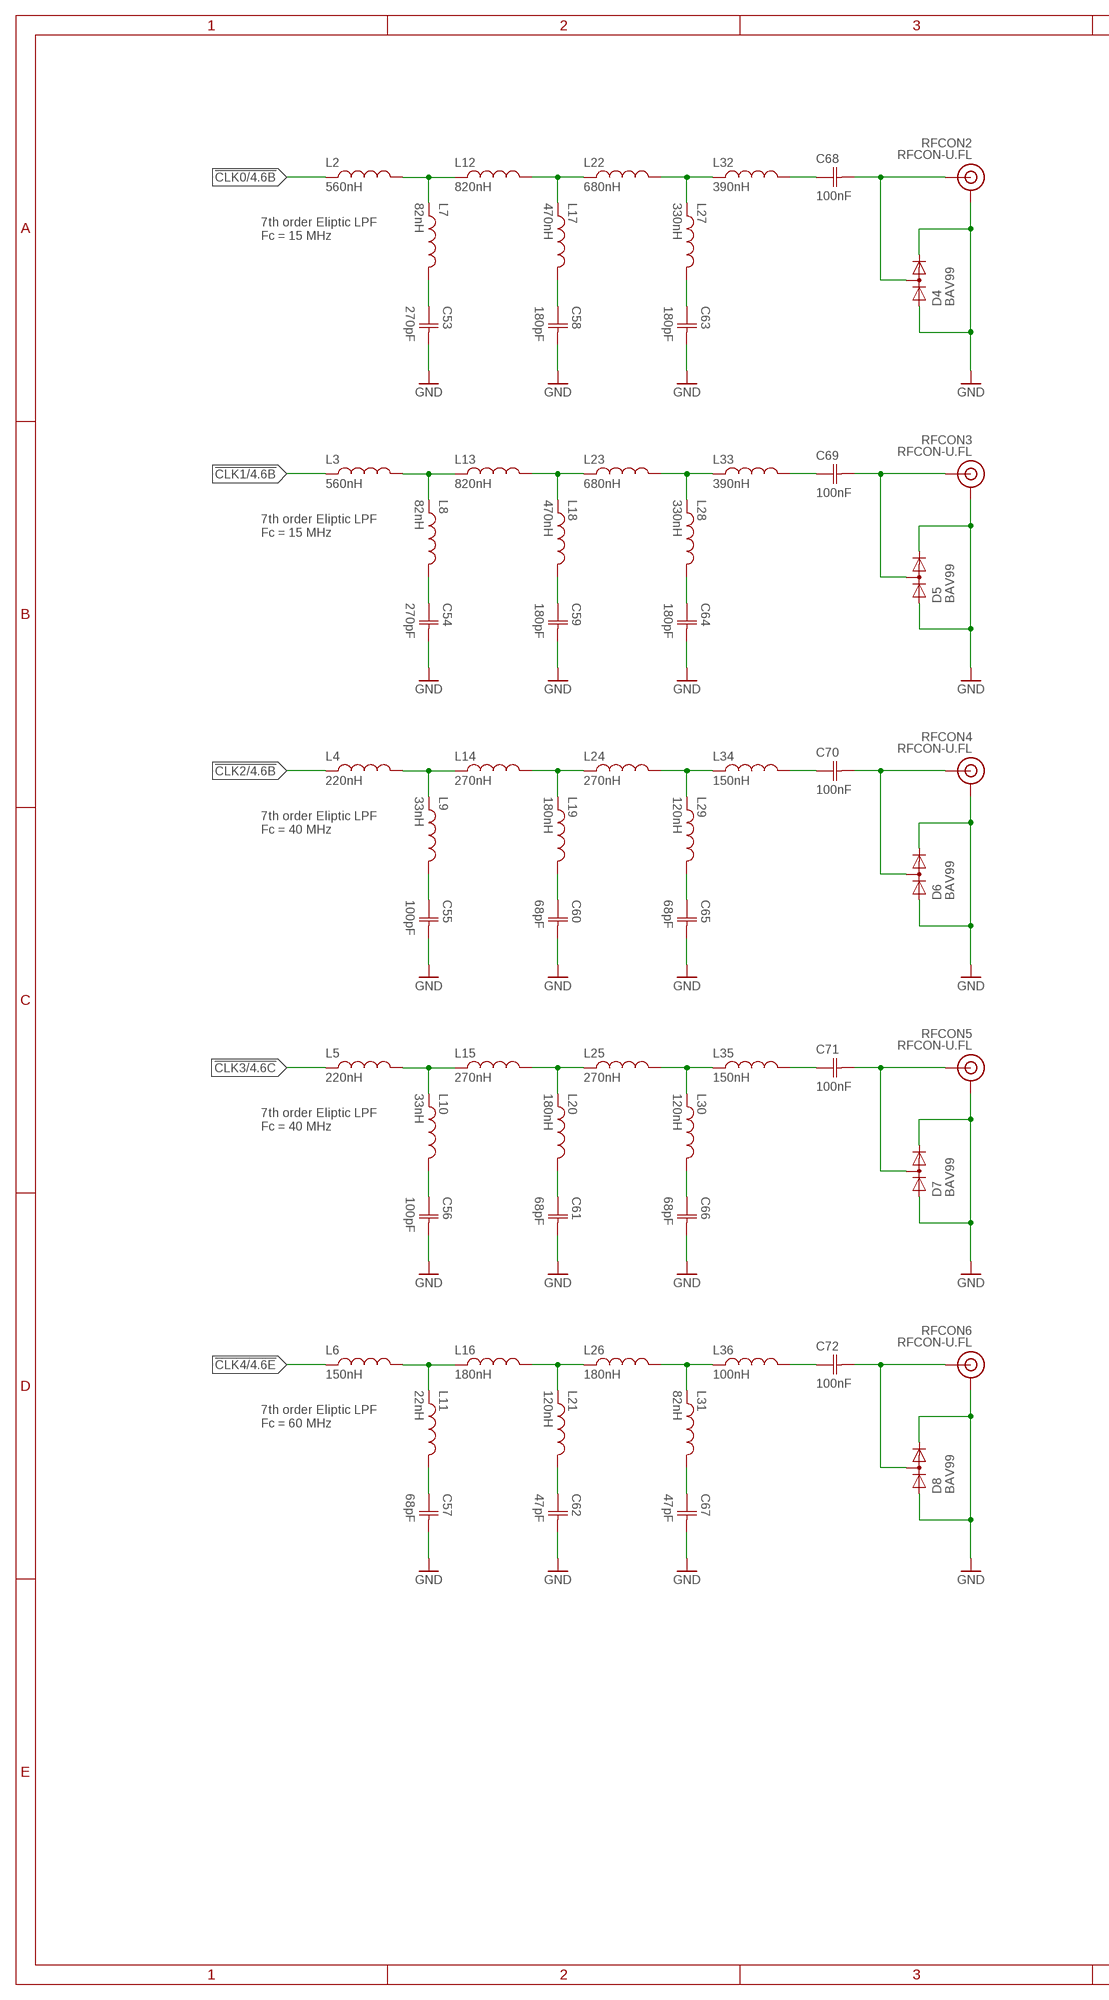
[diagram p8: schematic, sheet 5, part 1 of 2]
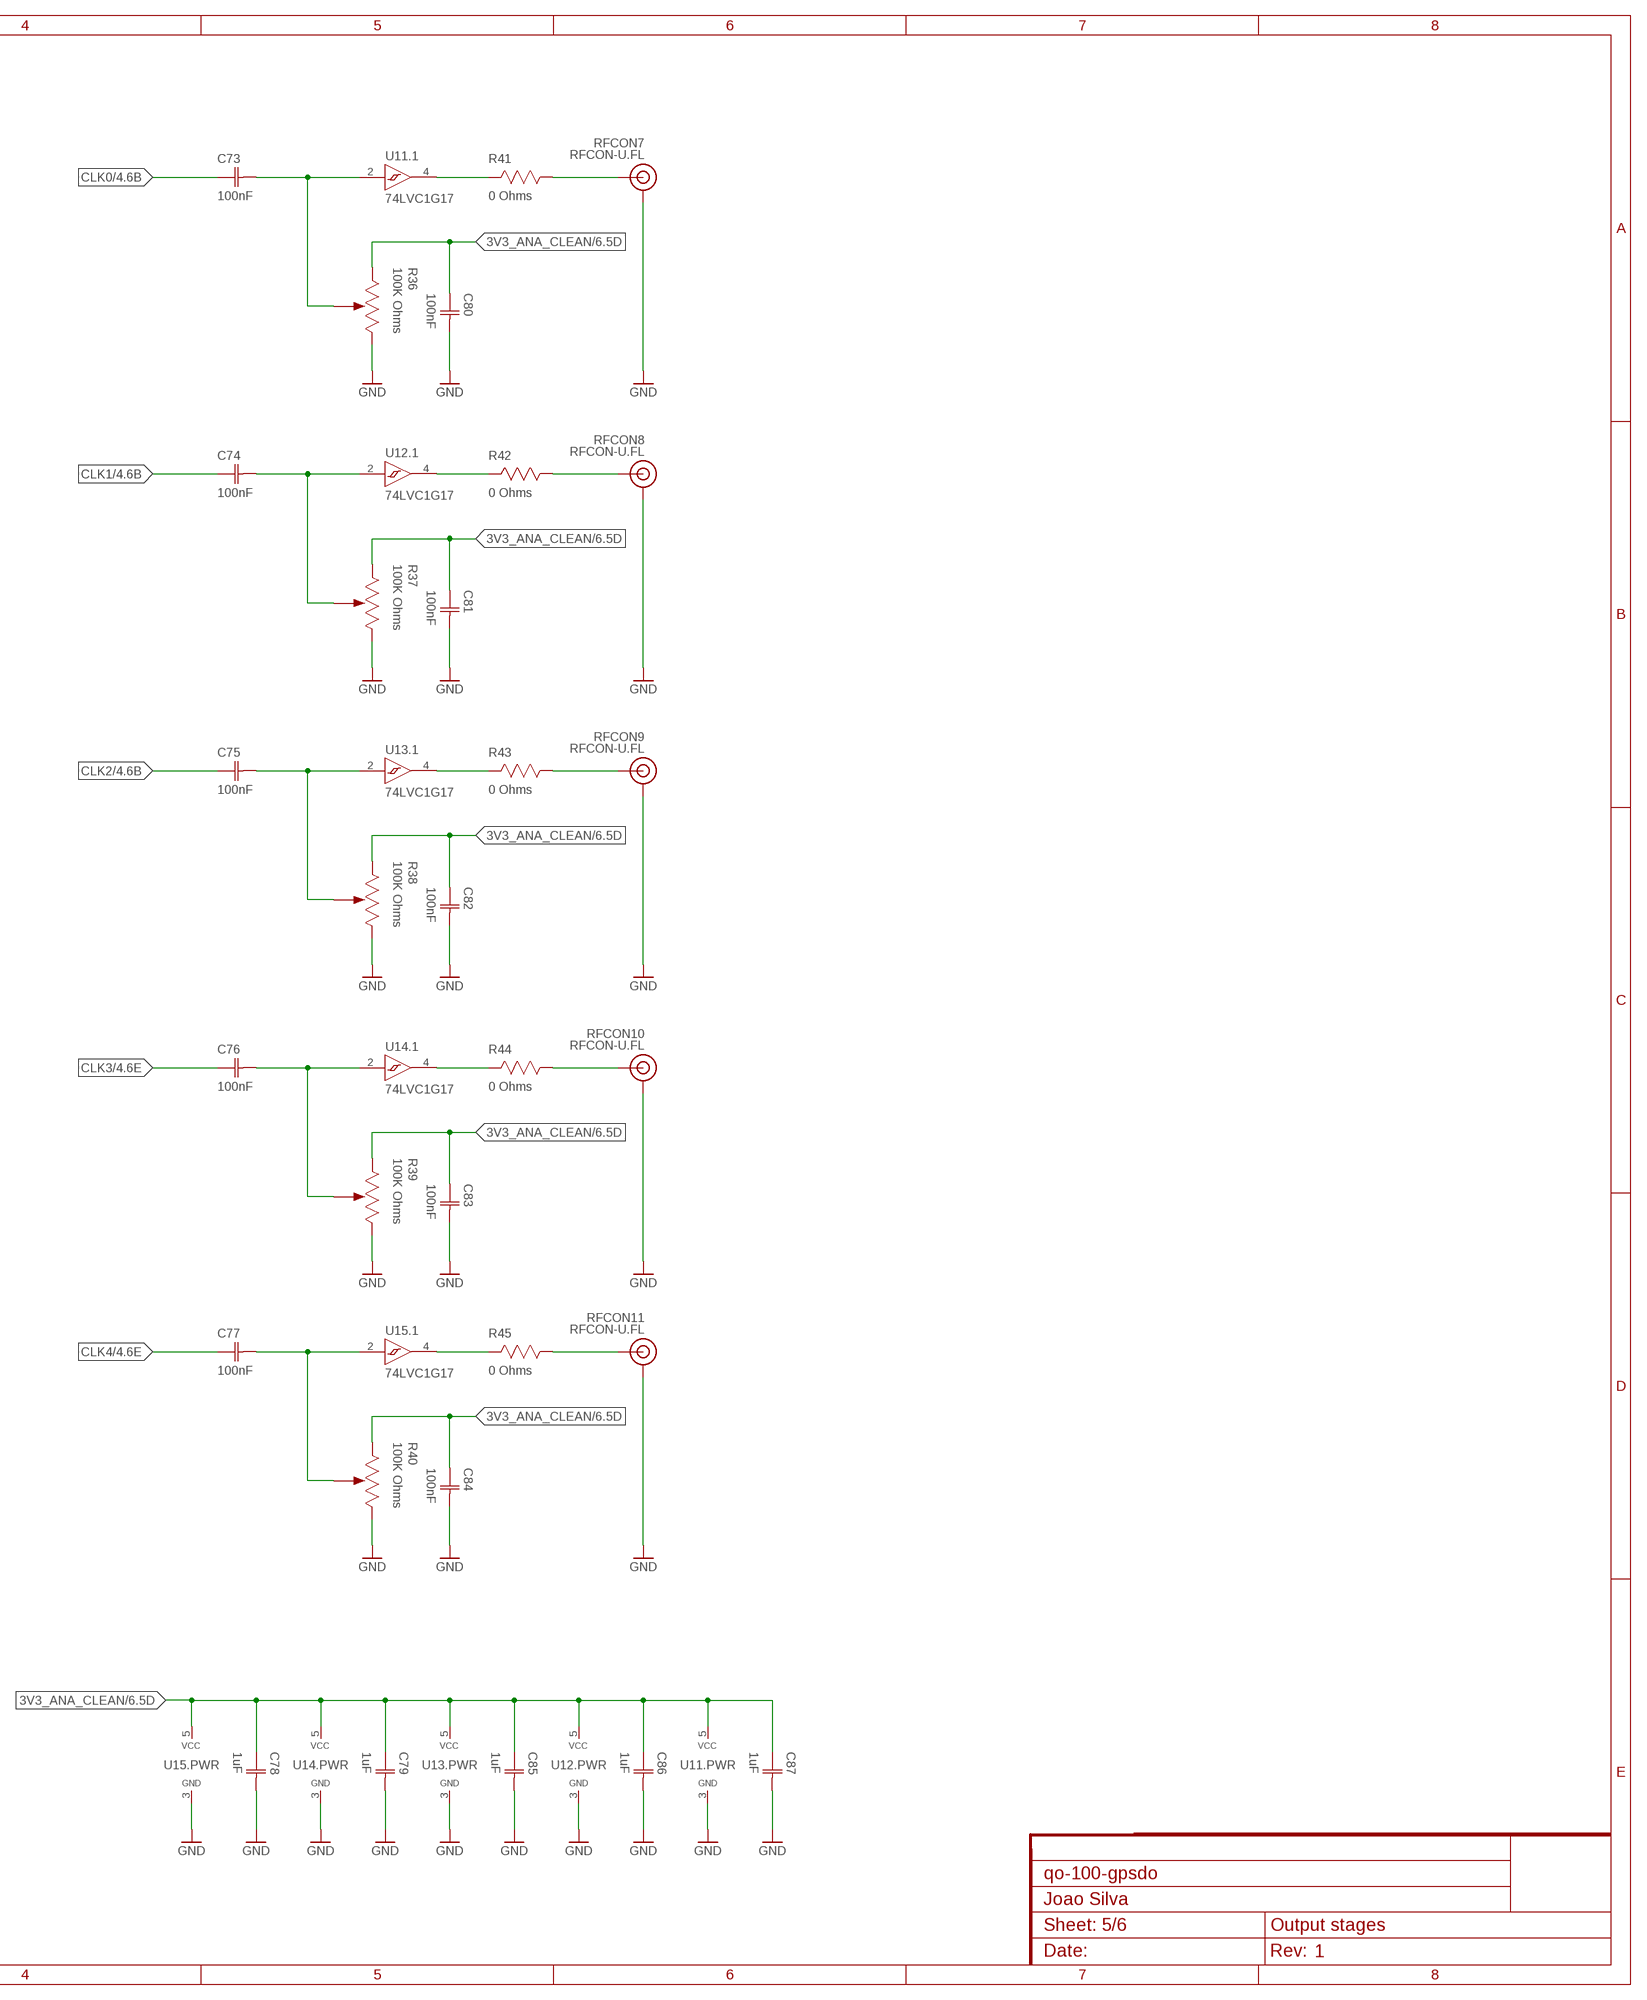
[diagram p9: schematic, sheet 5, part 2 of 2]

### Parts
C53  270pF  CAPACITOR-0402  [CAP0402]
C54  270pF  CAPACITOR-0402  [CAP0402]
C55  100pF  CAPACITOR-0402  [CAP0402]
C56  100pF  CAPACITOR-0402  [CAP0402]
C57  68pF  CAPACITOR-0402  [CAP0402]
C58  180pF  CAPACITOR-0402  [CAP0402]
C59  180pF  CAPACITOR-0402  [CAP0402]
C60  68pF  CAPACITOR-0402  [CAP0402]
C61  68pF  CAPACITOR-0402  [CAP0402]
C62  47pF  CAPACITOR-0402  [CAP0402]
C63  180pF  CAPACITOR-0402  [CAP0402]
C64  180pF  CAPACITOR-0402  [CAP0402]
C65  68pF  CAPACITOR-0402  [CAP0402]
C66  68pF  CAPACITOR-0402  [CAP0402]
C67  47pF  CAPACITOR-0402  [CAP0402]
C68  100nF  CAPACITOR-0402  [CAP0402]
C69  100nF  CAPACITOR-0402  [CAP0402]
C70  100nF  CAPACITOR-0402  [CAP0402]
C71  100nF  CAPACITOR-0402  [CAP0402]
C72  100nF  CAPACITOR-0402  [CAP0402]
C73  100nF  CAPACITOR-0402  [CAP0402]
C74  100nF  CAPACITOR-0402  [CAP0402]
C75  100nF  CAPACITOR-0402  [CAP0402]
C76  100nF  CAPACITOR-0402  [CAP0402]
C77  100nF  CAPACITOR-0402  [CAP0402]
C78  1uF  CAPACITOR-0402  [CAP0402]
C79  1uF  CAPACITOR-0402  [CAP0402]
C80  100nF  CAPACITOR-0402  [CAP0402]
C81  100nF  CAPACITOR-0402  [CAP0402]
C82  100nF  CAPACITOR-0402  [CAP0402]
C83  100nF  CAPACITOR-0402  [CAP0402]
C84  100nF  CAPACITOR-0402  [CAP0402]
C85  1uF  CAPACITOR-0402  [CAP0402]
C86  1uF  CAPACITOR-0402  [CAP0402]
C87  1uF  CAPACITOR-0402  [CAP0402]
D4  BAV99  [SOT23]
D5  BAV99  [SOT23]
D6  BAV99  [SOT23]
D7  BAV99  [SOT23]
D8  BAV99  [SOT23]
L2  560nH  INDUCTOR-0402  [IND0402]
L3  560nH  INDUCTOR-0402  [IND0402]
L4  220nH  INDUCTOR-0402  [IND0402]
L5  220nH  INDUCTOR-0402  [IND0402]
L6  150nH  INDUCTOR-0402  [IND0402]
L7  82nH  INDUCTOR-0402  [IND0402]
L8  82nH  INDUCTOR-0402  [IND0402]
L9  33nH  INDUCTOR-0402  [IND0402]
L10  33nH  INDUCTOR-0402  [IND0402]
L11  22nH  INDUCTOR-0402  [IND0402]
L12  820nH  INDUCTOR-0402  [IND0402]
L13  820nH  INDUCTOR-0402  [IND0402]
L14  270nH  INDUCTOR-0402  [IND0402]
L15  270nH  INDUCTOR-0402  [IND0402]
L16  180nH  INDUCTOR-0402  [IND0402]
L17  470nH  INDUCTOR-0402  [IND0402]
L18  470nH  INDUCTOR-0402  [IND0402]
L19  180nH  INDUCTOR-0402  [IND0402]
L20  180nH  INDUCTOR-0402  [IND0402]
L21  120nH  INDUCTOR-0402  [IND0402]
L22  680nH  INDUCTOR-0402  [IND0402]
L23  680nH  INDUCTOR-0402  [IND0402]
L24  270nH  INDUCTOR-0402  [IND0402]
L25  270nH  INDUCTOR-0402  [IND0402]
L26  180nH  INDUCTOR-0402  [IND0402]
L27  330nH  INDUCTOR-0402  [IND0402]
L28  330nH  INDUCTOR-0402  [IND0402]
L29  120nH  INDUCTOR-0402  [IND0402]
L30  120nH  INDUCTOR-0402  [IND0402]
L31  82nH  INDUCTOR-0402  [IND0402]
L32  390nH  INDUCTOR-0402  [IND0402]
L33  390nH  INDUCTOR-0402  [IND0402]
L34  150nH  INDUCTOR-0402  [IND0402]
L35  150nH  INDUCTOR-0402  [IND0402]
L36  100nH  INDUCTOR-0402  [IND0402]
R36  100K Ohms  POTENTIOMETER-SMD-3X3  [POT3MM]
R37  100K Ohms  POTENTIOMETER-SMD-3X3  [POT3MM]
R38  100K Ohms  POTENTIOMETER-SMD-3X3  [POT3MM]
R39  100K Ohms  POTENTIOMETER-SMD-3X3  [POT3MM]
R40  100K Ohms  POTENTIOMETER-SMD-3X3  [POT3MM]
R41  0 Ohms  RESISTOR-0402  [RES0402]
R42  0 Ohms  RESISTOR-0402  [RES0402]
R43  0 Ohms  RESISTOR-0402  [RES0402]
R44  0 Ohms  RESISTOR-0402  [RES0402]
R45  0 Ohms  RESISTOR-0402  [RES0402]
RFCON2  RFCON-U.FL  [U.FL]
RFCON3  RFCON-U.FL  [U.FL]
RFCON4  RFCON-U.FL  [U.FL]
RFCON5  RFCON-U.FL  [U.FL]
RFCON6  RFCON-U.FL  [U.FL]
RFCON7  RFCON-U.FL  [U.FL]
RFCON8  RFCON-U.FL  [U.FL]
RFCON9  RFCON-U.FL  [U.FL]
RFCON10  RFCON-U.FL  [U.FL]
RFCON11  RFCON-U.FL  [U.FL]
U11  74LVC1G17  [SC70-5]
U12  74LVC1G17  [SC70-5]
U13  74LVC1G17  [SC70-5]
U14  74LVC1G17  [SC70-5]
U15  74LVC1G17  [SC70-5]

### Nets
3V3_ANA_CLEAN: C78.1(C1) C79.1(C1) C80.1(C1) C81.1(C1) C82.1(C1) C83.1(C1) C84.1(C1) C85.1(C1) C86.1(C1) C87.1(C1) R36.1(CCW) R37.1(CCW) R38.1(CCW) R39.1(CCW) R40.1(CCW) U11.5(.PWR:VCC) U12.5(.PWR:VCC) U13.5(.PWR:VCC) U14.5(.PWR:VCC) U15.5(.PWR:VCC) ; also sheet 6
!CLK0: L2.1 ; also sheet 4
!CLK1: L3.1 ; also sheet 4
!CLK2: L4.1 ; also sheet 4
!CLK3: L5.1 ; also sheet 4
!CLK4: L6.1 ; also sheet 4
CLK0: C73.1(C1) ; also sheet 4
CLK1: C74.1(C1) ; also sheet 4
CLK2: C75.1(C1) ; also sheet 4
CLK3: C76.1(C1) ; also sheet 4
CLK4: C77.1(C1) ; also sheet 4
GND: C53.2(C2) C54.2(C2) C55.2(C2) C56.2(C2) C57.2(C2) C58.2(C2) C59.2(C2) C60.2(C2) C61.2(C2) C62.2(C2) C63.2(C2) C64.2(C2) C65.2(C2) C66.2(C2) C67.2(C2) C78.2(C2) C79.2(C2) C80.2(C2) C81.2(C2) C82.2(C2) C83.2(C2) C84.2(C2) C85.2(C2) C86.2(C2) C87.2(C2) D4.1(A) D4.2(C) D5.1(A) D5.2(C) D6.1(A) D6.2(C) D7.1(A) D7.2(C) D8.1(A) D8.2(C) R36.3(CW) R37.3(CW) R38.3(CW) R39.3(CW) R40.3(CW) RFCON2.P$1(GND) RFCON2.P$2(GND) RFCON3.P$1(GND) RFCON3.P$2(GND) RFCON4.P$1(GND) RFCON4.P$2(GND) RFCON5.P$1(GND) RFCON5.P$2(GND) RFCON6.P$1(GND) RFCON6.P$2(GND) RFCON7.P$1(GND) RFCON7.P$2(GND) RFCON8.P$1(GND) RFCON8.P$2(GND) RFCON9.P$1(GND) RFCON9.P$2(GND) RFCON10.P$1(GND) RFCON10.P$2(GND) RFCON11.P$1(GND) RFCON11.P$2(GND) U11.3(.PWR:GND) U12.3(.PWR:GND) U13.3(.PWR:GND) U14.3(.PWR:GND) U15.3(.PWR:GND) ; also sheet 1,2,3,4,6
N$1: C53.1(C1) L7.2
N$2: C58.1(C1) L17.2
N$3: C63.1(C1) L27.2
N$4: C68.1(C1) L32.2
N$5: L3.2 L8.1 L13.1
N$6: L13.2 L18.1 L23.1
N$8: R45.1 RFCON11.P$3(SIGNAL)
N$10: C69.2(C2) D5.3(MID) RFCON3.P$3(SIGNAL)
N$16: C77.2(C2) R40.2(WIPER) U15.2(.1:A)
N$24: R45.2 U15.4(.1:Y)
N$25: R44.1 RFCON10.P$3(SIGNAL)
N$29: R44.2 U14.4(.1:Y)
N$32: C76.2(C2) R39.2(WIPER) U14.2(.1:A)
N$33: L23.2 L28.1 L33.1
N$34: C54.1(C1) L8.2
N$35: C59.1(C1) L18.2
N$36: C64.1(C1) L28.2
N$38: C69.1(C1) L33.2
N$39: L2.2 L7.1 L12.1
N$40: L12.2 L17.1 L22.1
N$41: C68.2(C2) D4.3(MID) RFCON2.P$3(SIGNAL)
N$42: L22.2 L27.1 L32.1
N$43: L4.2 L9.1 L14.1
N$44: L14.2 L19.1 L24.1
N$45: C70.2(C2) D6.3(MID) RFCON4.P$3(SIGNAL)
N$46: L24.2 L29.1 L34.1
N$47: C55.1(C1) L9.2
N$48: C60.1(C1) L19.2
N$49: C65.1(C1) L29.2
N$50: C70.1(C1) L34.2
N$51: L5.2 L10.1 L15.1
N$52: L15.2 L20.1 L25.1
N$53: C71.2(C2) D7.3(MID) RFCON5.P$3(SIGNAL)
N$54: L25.2 L30.1 L35.1
N$55: C56.1(C1) L10.2
N$56: C61.1(C1) L20.2
N$57: C66.1(C1) L30.2
N$58: C71.1(C1) L35.2
N$59: L6.2 L11.1 L16.1
N$60: L16.2 L21.1 L26.1
N$61: C72.2(C2) D8.3(MID) RFCON6.P$3(SIGNAL)
N$62: L26.2 L31.1 L36.1
N$63: C57.1(C1) L11.2
N$64: C62.1(C1) L21.2
N$65: C67.1(C1) L31.2
N$66: C72.1(C1) L36.2
N$67: R43.1 RFCON9.P$3(SIGNAL)
N$68: R43.2 U13.4(.1:Y)
N$69: C75.2(C2) R38.2(WIPER) U13.2(.1:A)
N$70: R42.1 RFCON8.P$3(SIGNAL)
N$71: R42.2 U12.4(.1:Y)
N$72: C74.2(C2) R37.2(WIPER) U12.2(.1:A)
N$73: R41.1 RFCON7.P$3(SIGNAL)
N$74: R41.2 U11.4(.1:Y)
N$75: C73.2(C2) R36.2(WIPER) U11.2(.1:A)

### Notes on the sheet
- 7th order Eliptic LPF
  Fc = 15 MHz
- 7th order Eliptic LPF
  Fc = 15 MHz
- 7th order Eliptic LPF
  Fc = 40 MHz
- 7th order Eliptic LPF
  Fc = 40 MHz
- 7th order Eliptic LPF
  Fc = 60 MHz

## Sheet 6 of 6: Power
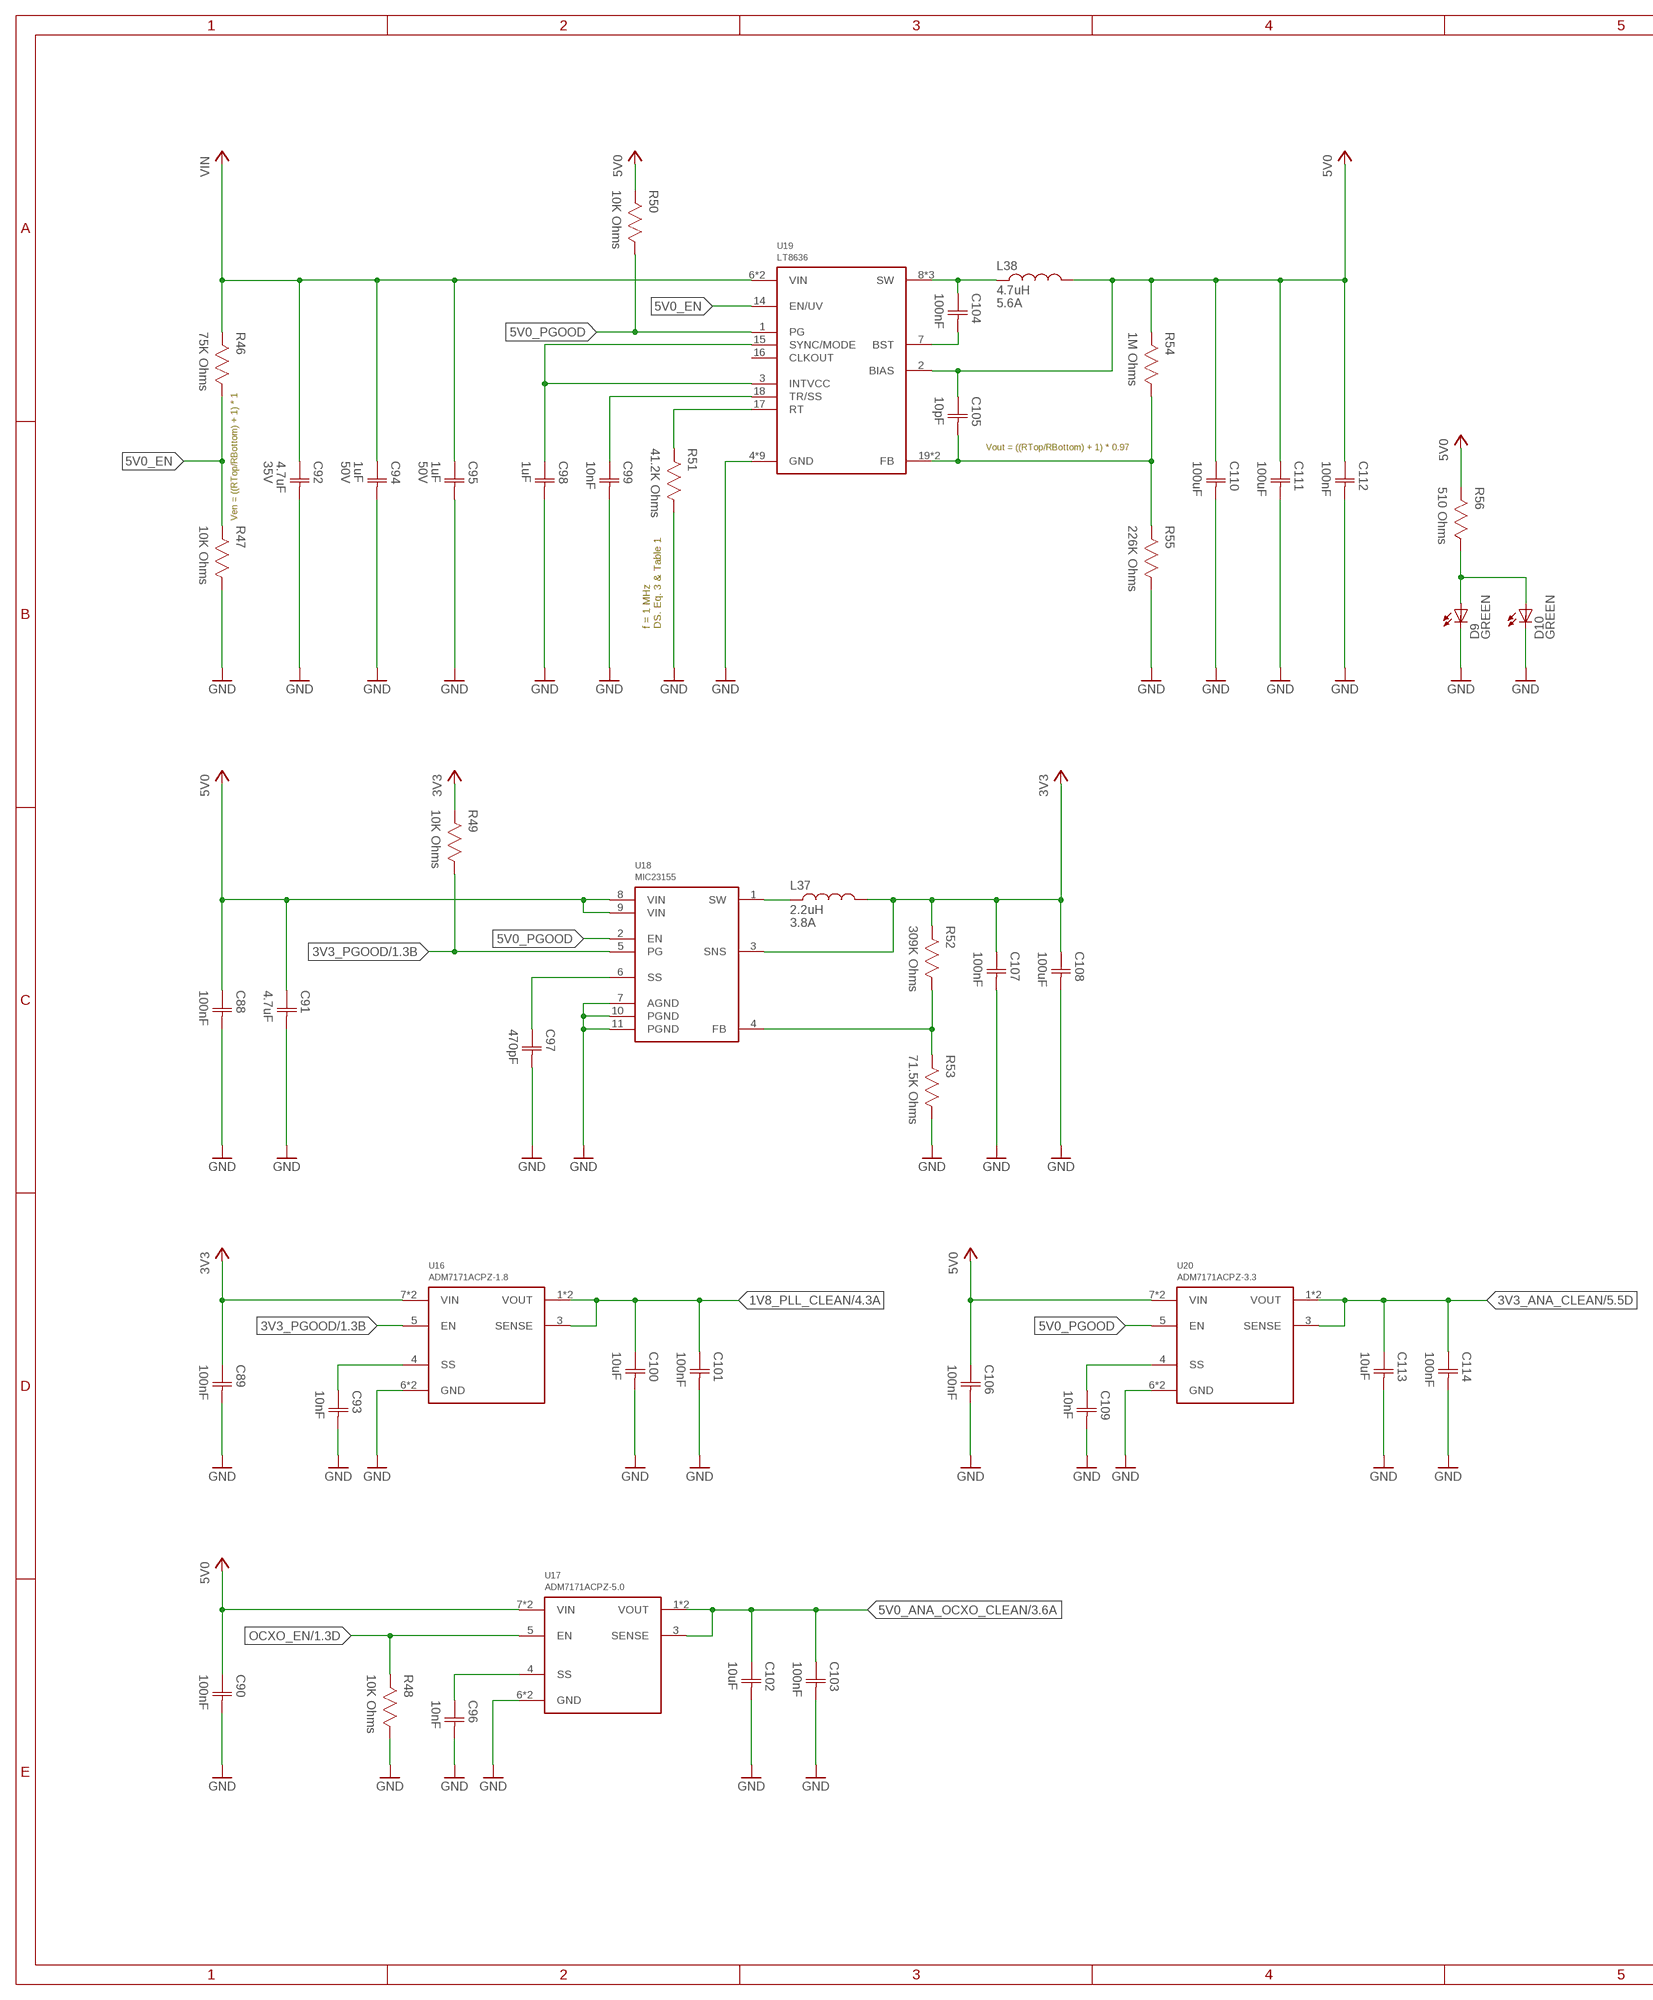
[diagram p10: schematic, sheet 6, part 1 of 2]
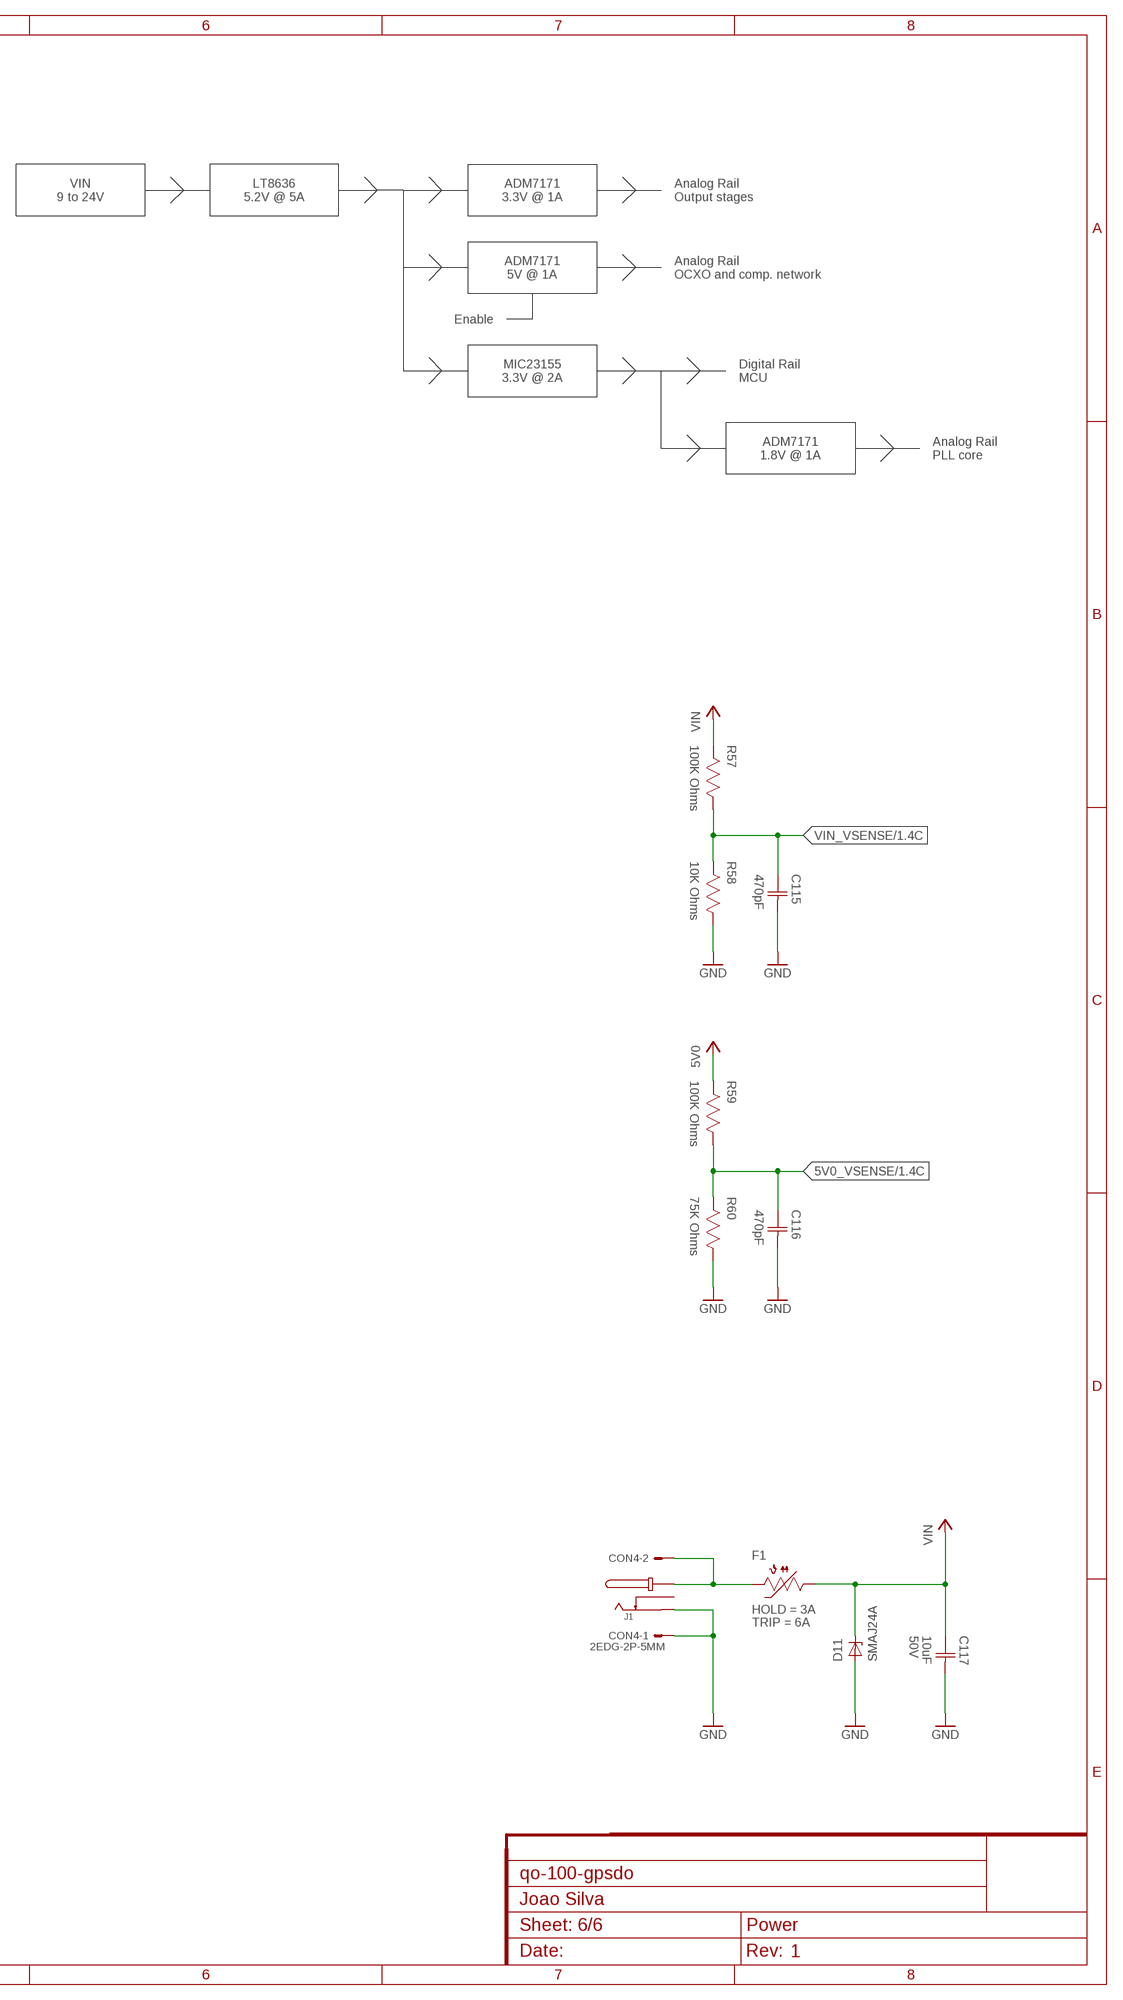
[diagram p11: schematic, sheet 6, part 2 of 2]

### Parts
C88  100nF  CAPACITOR-0402  [CAP0402]
C89  100nF  CAPACITOR-0402  [CAP0402]
C90  100nF  CAPACITOR-0402  [CAP0402]
C91  4.7uF  CAPACITOR-0603  [CAP0603]
C92  4.7uF  CAPACITOR-0603  [CAP0603]
C93  10nF  CAPACITOR-0402  [CAP0402]
C94  1uF  CAPACITOR-0603  [CAP0603]
C95  1uF  CAPACITOR-0603  [CAP0603]
C96  10nF  CAPACITOR-0402  [CAP0402]
C97  470pF  CAPACITOR-0402  [CAP0402]
C98  1uF  CAPACITOR-0402  [CAP0402]
C99  10nF  CAPACITOR-0402  [CAP0402]
C100  10uF  CAPACITOR-0603  [CAP0603]
C101  100nF  CAPACITOR-0402  [CAP0402]
C102  10uF  CAPACITOR-0603  [CAP0603]
C103  100nF  CAPACITOR-0402  [CAP0402]
C104  100nF  CAPACITOR-0402  [CAP0402]
C105  10pF  CAPACITOR-0402  [CAP0402]
C106  100nF  CAPACITOR-0402  [CAP0402]
C107  100nF  CAPACITOR-0402  [CAP0402]
C108  100uF  CAPACITOR-1206  [CAP1206]
C109  10nF  CAPACITOR-0402  [CAP0402]
C110  100uF  CAPACITOR-1206  [CAP1206]
C111  100uF  CAPACITOR-1206  [CAP1206]
C112  100nF  CAPACITOR-0402  [CAP0402]
C113  10uF  CAPACITOR-0603  [CAP0603]
C114  100nF  CAPACITOR-0402  [CAP0402]
C115  470pF  CAPACITOR-0402  [CAP0402]
C116  470pF  CAPACITOR-0402  [CAP0402]
C117  10uF  CAPACITOR-1206  [CAP1206]
CON4  2EDG-2P-5MM  [2EDG-2P-5MM]
D9  LED0603  [0603]
D10  LEDTH3MM  [LED_3MM]
D11  SMAJ24A  [DO214AC]
F1  2.6A Hold  PTC1206  [1206]
J1  DCJACK  [DC-050]
L37  2.2uH  INDUCTOR-3.2X3.5X1.5MM  [IND3515]
L38  4.7uH  INDUCTOR-4X4MM  [IND0404]
R46  75K Ohms  RESISTOR-0402  [RES0402]
R47  10K Ohms  RESISTOR-0402  [RES0402]
R48  10K Ohms  RESISTOR-0402  [RES0402]
R49  10K Ohms  RESISTOR-0402  [RES0402]
R50  10K Ohms  RESISTOR-0402  [RES0402]
R51  41.2K Ohms  RESISTOR-0402  [RES0402]
R52  309K Ohms  RESISTOR-0402  [RES0402]
R53  71.5K Ohms  RESISTOR-0402  [RES0402]
R54  1M Ohms  RESISTOR-0402  [RES0402]
R55  226K Ohms  RESISTOR-0402  [RES0402]
R56  510 Ohms  RESISTOR-0402  [RES0402]
R57  100K Ohms  RESISTOR-0402  [RES0402]
R58  10K Ohms  RESISTOR-0402  [RES0402]
R59  100K Ohms  RESISTOR-0402  [RES0402]
R60  75K Ohms  RESISTOR-0402  [RES0402]
U16  ADM7171ACPZ-1.8  [LFCSP8_3X3]
U17  ADM7171ACPZ-5.0  [LFCSP8_3X3]
U18  MIC23155  [DFN10]
U19  LT8636  [QFN20_ASYM_3X4_CORNER]
U20  ADM7171ACPZ-3.3  [LFCSP8_3X3]

### Nets
1V8_PLL_CLEAN: C100.1(C1) C101.1(C1) U16.1(VOUT) U16.2(VOUT) U16.3(SENSE) ; also sheet 4
3V3: C89.1(C1) C107.1(C1) C108.1(C1) L37.2 R49.2 R52.2 U16.7(VIN) U16.8(VIN) U18.3(SNS) ; also sheet 1,2,3,4
3V3_ANA_CLEAN: C113.1(C1) C114.1(C1) U20.1(VOUT) U20.2(VOUT) U20.3(SENSE) ; also sheet 5
3V3_FB: R52.1 R53.2 U18.4(FB)
3V3_PGOOD: R49.1 U16.5(EN) U18.5(PG) ; also sheet 1
3V3_SS: C97.1(C1) U18.6(SS)
3V3_SW: L37.1 U18.1(SW)
5V0: C88.1(C1) C90.1(C1) C91.1(C1) C105.1(C1) C106.1(C1) C110.1(C1) C111.1(C1) C112.1(C1) L38.2 R50.2 R54.2 R56.2 R59.2 U17.7(VIN) U17.8(VIN) U18.8(VIN) U18.9(VIN) U19.2(BIAS) U20.7(VIN) U20.8(VIN) ; also sheet 2
5V0_ANA_OCXO_CLEAN: C102.1(C1) C103.1(C1) U17.1(VOUT) U17.2(VOUT) U17.3(SENSE) ; also sheet 3
5V0_BST: C104.2(C2) U19.7(BST)
5V0_EN: R46.1 R47.2 U19.14(EN/UV)
5V0_FB: C105.2(C2) R54.1 R55.2 U19.19(FB) U19.20(FB)
5V0_INTVCC: C98.1(C1) U19.3(INTVCC) U19.15(SYNC/MODE)
5V0_PGOOD: R50.1 U18.2(EN) U19.1(PG) U20.5(EN)
5V0_RT: R51.2 U19.17(RT)
5V0_SS: C99.1(C1) U19.18(TR/SS)
5V0_SW: C104.1(C1) L38.1 U19.8(SW) U19.9(SW) U19.10(SW)
5V0_VSENSE: C116.1(C1) R59.1 R60.2 ; also sheet 1
GND: C88.2(C2) C89.2(C2) C90.2(C2) C91.2(C2) C92.2(C2) C93.2(C2) C94.2(C2) C95.2(C2) C96.2(C2) C97.2(C2) C98.2(C2) C99.2(C2) C100.2(C2) C101.2(C2) C102.2(C2) C103.2(C2) C106.2(C2) C107.2(C2) C108.2(C2) C109.2(C2) C110.2(C2) C111.2(C2) C112.2(C2) C113.2(C2) C114.2(C2) C115.2(C2) C116.2(C2) C117.2(C2) CON4.P$1 D9.C D10.K(C) D11.A J1.O R47.1 R48.1 R51.1 R53.1 R55.1 R58.1 R60.1 U16.6(GND) U16.9(GND) U17.6(GND) U17.9(GND) U18.7(AGND) U18.10(PGND) U18.11(PGND) U19.4(GND) U19.5(GND) U19.12(GND) U19.13(GND) U19.21(GND) U19.M1(GND) U19.M2(GND) U19.M3(GND) U19.M4(GND) U20.6(GND) U20.9(GND) ; also sheet 1,2,3,4,5
N$26: C109.1(C1) U20.4(SS)
N$28: C96.1(C1) U17.4(SS)
N$31: CON4.P$2 F1.2 J1.C J1.C'(C)
N$105: C93.1(C1) U16.4(SS)
N$149: D9.A D10.A R56.1
OCXO_EN: R48.2 U17.5(EN) ; also sheet 1
VIN: C92.1(C1) C94.1(C1) C95.1(C1) C117.1(C1) D11.C F1.1 R46.2 R57.2 U19.6(VIN) U19.11(VIN)
VIN_VSENSE: C115.1(C1) R57.1 R58.2 ; also sheet 1
Unconnected: J1.DT U19.16(CLKOUT)

### Notes on the sheet
- VIN
  9 to 24V
- LT8636
  5.2V @ 5A
- ADM7171
  3.3V @ 1A
- Analog Rail
  Output stages
- ADM7171
  5V @ 1A
- Analog Rail
  OCXO and comp. network
- Enable
- MIC23155
  3.3V @ 2A
- Digital Rail
  MCU
- Ven = ((RTop/RBottom) + 1) * 1
- Vout = ((RTop/RBottom) + 1) * 0.97
- ADM7171
  1.8V @ 1A
- Analog Rail
  PLL core
- f = 1 MHz
  DS. Eq. 3 & Table 1

## Library data of the parts
BAT1 = Battery:CR2032
C1-C91 C93 C96-C116 = Capacitor:CAPACITOR
C92 = Capacitor:CAPACITOR; VOLTAGE: 35V
C94 C95 C117 = Capacitor:CAPACITOR; VOLTAGE: 50V
CON1 CON3 = JST:3P: Disconnectable Crimp style connector, 1.0mm pitch 3 contacts
CON2 = JST:4P: Disconnectable Crimp style connector, 1.0mm pitch 4 contacts
CON4 = Generic Connector:2EDG-2P
D1 D2 = LED:LED; COLOR: BLUE
D3 = Generic Diode:B0530W
D4-D8 = Generic Diode:BAV99
D9 D10 = LED:LED; COLOR: GREEN
D11 = TVS:SMAJ*A: SMAJ Series TVS Diodes Source: http://www.littelfuse.com/~/media/electronics/datasheets/tvs_diodes/littelfuse_tvs_diode_smaj_datasheet.pdf.pdf; MF: Littelfuse; MPN: SMAJ24A; OC_FARNELL: 1886345; OC_NEWARK: 06R1865
F1 = PTC Fuses:PTC; HOLD: 3A; OCLCSC: C207041; TRIP: 6A
FB1-FB6 = Inductor:FERRITE
J1 = Barrel Jack:DCJACK
L1-L36 = Inductor:INDUCTOR
L37 = Inductor:INDUCTOR; CURRENT: 3.8A; REF_COILCRAFT: XGL3515-222ME
L38 = Inductor:INDUCTOR; CURRENT: 5.6A; REF_COILCRAFT: XGL4020-472ME
LOGO1 = Silkscreen:JS
R1-R35 R41-R60 = Resistor:RESISTOR
R36-R40 = Potentiometer:POTENTIOMETER
RFCON1-RFCON11 = RF Connector:RFCON
TC1 = TagConnect:TC2050-IDC
U1 = EFM32:EFM32GG11B4*L112
U2 U3 U11-U15 = Logic:74LVC1G17
U4 = U-Blox:MAX-M8*
U5 = Microchip:MCP1501-*
U6 = Analog Devices:AD5541A?
U7 = Microchip:MCP6V31
U8 = Crystal:OSC5A2B02
U9 = Crystal:DSB321SDA
U10 = Analog Devices:AD9544
U16 U17 U20 = Analog Devices:ADM7171ACPZ
U18 = Microchip:MIC23155
U19 = Analog Devices:LT8636